# Altium project Board.PrjPcb (part 1 of 2)
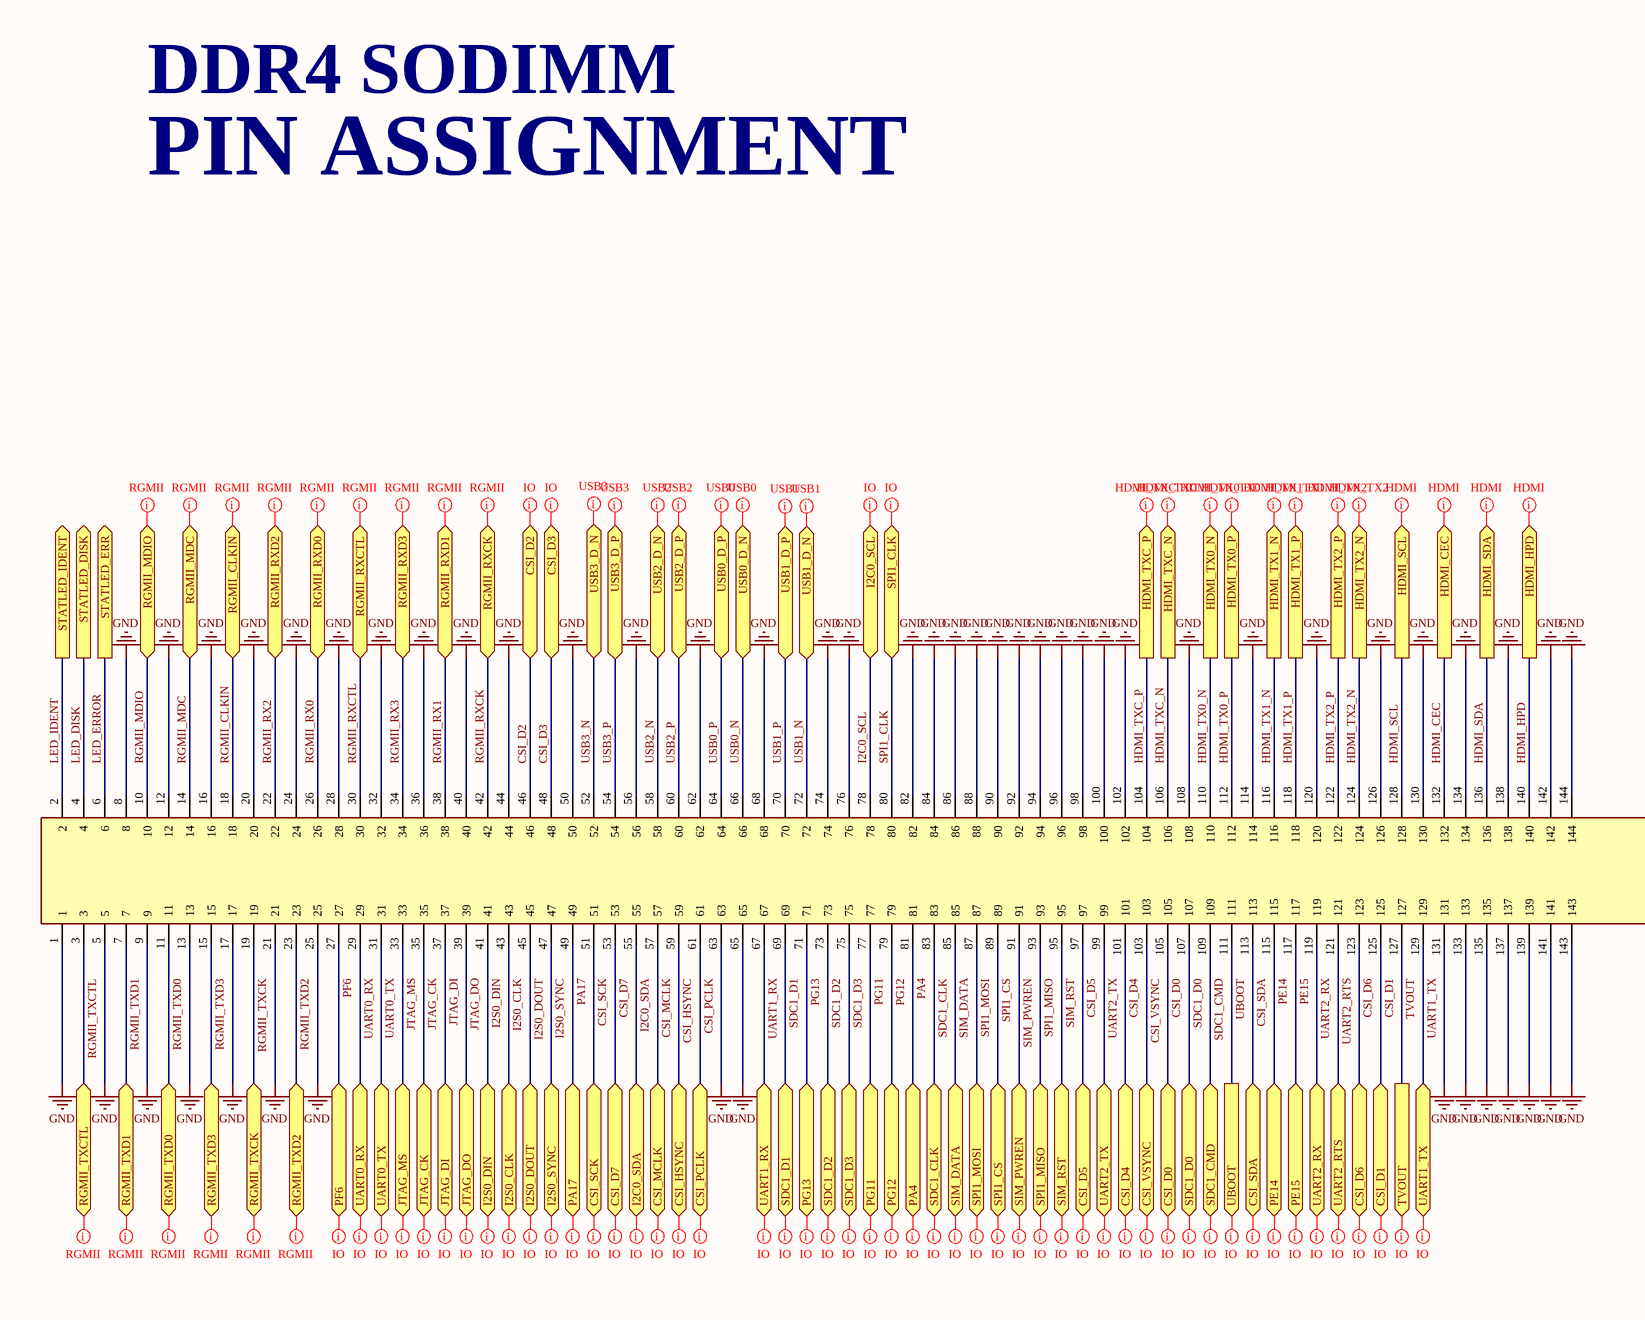
[diagram p0: 00_PINOUT.SchDoc, left]
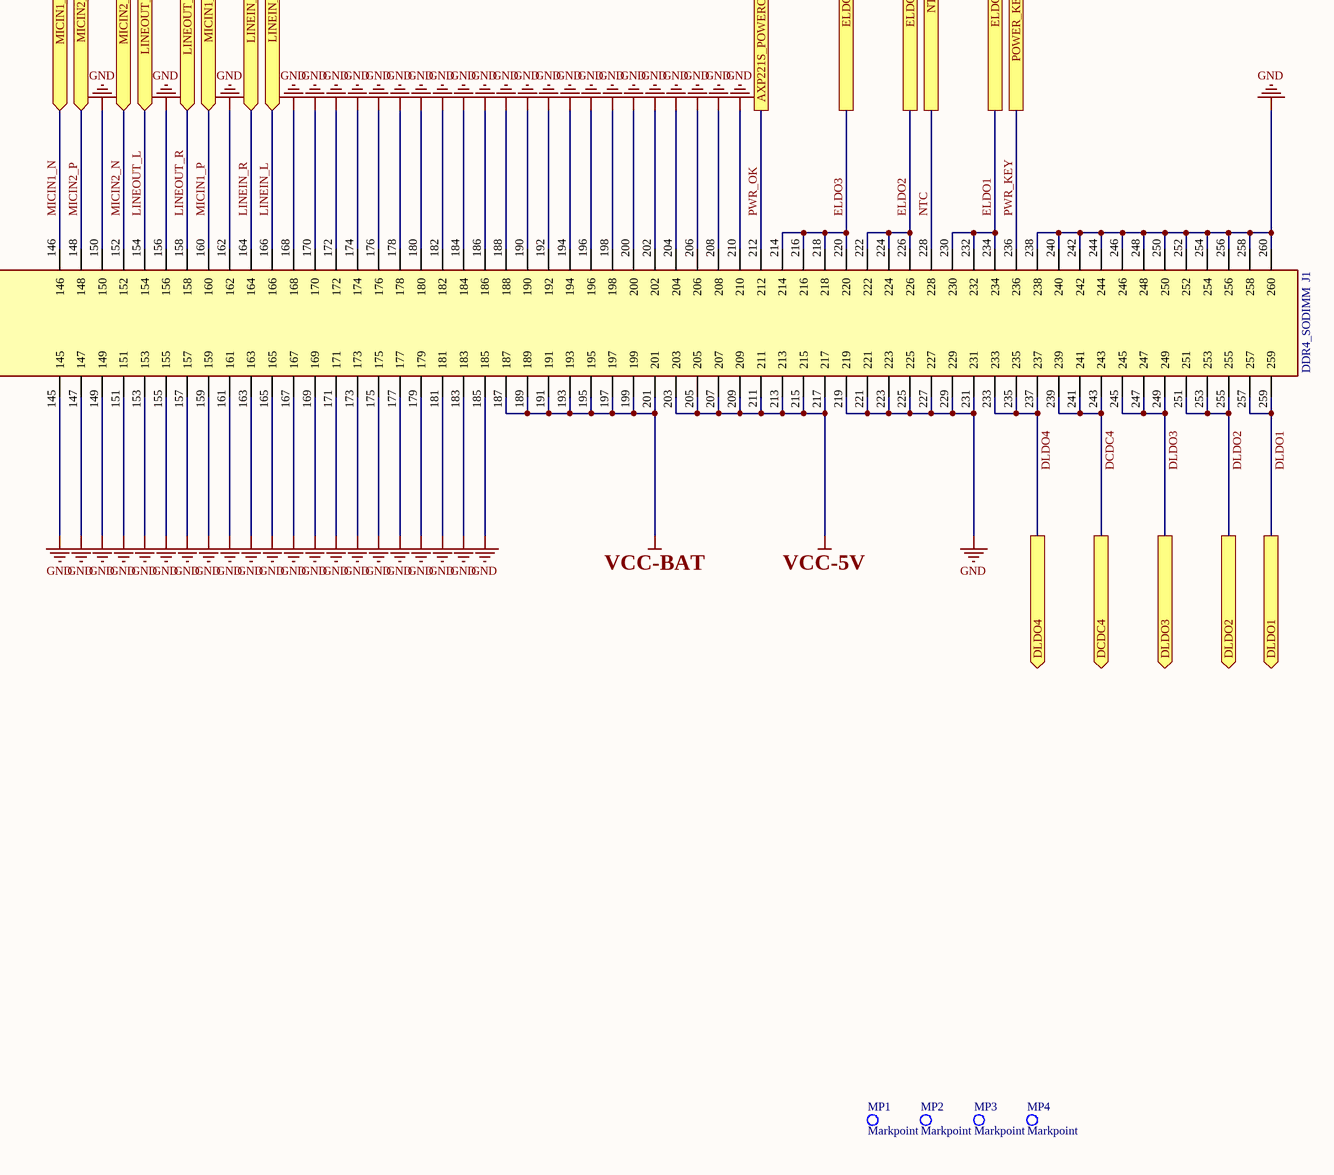
[diagram p1: 00_PINOUT.SchDoc, right]
7 sheets, 177 parts. Net scope: flat (ports and power ports of the same name join across sheets).
Board files: Board.PcbDoc, AXP221sBreakout.PcbDoc
Sheets:
  00_PINOUT.SchDoc
  01_POWER.SchDoc
  02_H3CORE.SchDoc
  03_H3DRAM.SchDoc
  04_H3STORAGE.SchDoc
  06_H3ETHERNET.SchDoc
  07_H3HDMI.SchDoc

## Sheet 00_PINOUT.SchDoc
size A2

### Parts
J1  DDR4_SODIMM  [DDR4_SODIMM]
MP1  Markpoint  [MARKPOINT]
MP2  Markpoint  [MARKPOINT]
MP3  Markpoint  [MARKPOINT]
MP4  Markpoint  [MARKPOINT]

### Ports
AXP221S_POWEROK (out), CSI_D0 (bidir), CSI_D1 (bidir), CSI_D2 (bidir), CSI_D3 (bidir), CSI_D4 (bidir), CSI_D5 (bidir), CSI_D6 (bidir), CSI_D7 (bidir), CSI_HSYNC (bidir), CSI_MCLK (bidir), CSI_PCLK (bidir), CSI_SCK (bidir), CSI_SDA (bidir), CSI_VSYNC (bidir), DCDC4 (out), DLDO1 (out), DLDO2 (out), DLDO3 (out), DLDO4 (out), ELDO1 (out), ELDO2 (out), ELDO3 (out), HDMI_CEC (out), HDMI_HPD (out), HDMI_SCL (out), HDMI_SDA (out), HDMI_TX0_N (out), HDMI_TX0_P (out), HDMI_TX1_N (out), HDMI_TX1_P (out), HDMI_TX2_N (out), HDMI_TX2_P (out), HDMI_TXC_N (out), HDMI_TXC_P (out), I2C0_SCL (bidir), I2C0_SDA (bidir), I2S0_CLK (bidir), I2S0_DIN (bidir), I2S0_DOUT (bidir), I2S0_SYNC (bidir), JTAG_CK (bidir), JTAG_DI (bidir), JTAG_DO (bidir), JTAG_MS (bidir), LINEIN_L (bidir), LINEIN_R (bidir), LINEOUT_L (bidir), LINEOUT_R (bidir), MICIN1_N (bidir), MICIN1_P (bidir), MICIN2_N (bidir), MICIN2_P (bidir), NTC (out), PA4 (bidir), PA17 (bidir), PE14 (bidir), PE15 (bidir), PF6 (bidir), PG11 (bidir), PG12 (bidir), PG13 (bidir), POWER_KEY (out), RGMII_CLKIN (bidir), RGMII_MDC (bidir), RGMII_MDIO (bidir), RGMII_RXCK (bidir), RGMII_RXCTL (bidir), RGMII_RXD0 (bidir), RGMII_RXD1 (bidir), RGMII_RXD2 (bidir), RGMII_RXD3 (bidir), RGMII_TXCK (bidir), RGMII_TXCTL (bidir), RGMII_TXD0 (bidir), RGMII_TXD1 (bidir), RGMII_TXD2 (bidir), RGMII_TXD3 (bidir), SDC1_CLK (bidir), SDC1_CMD (bidir), SDC1_D0 (bidir), SDC1_D1 (bidir), SDC1_D2 (bidir), SDC1_D3 (bidir), SIM_DATA (bidir), SIM_PWREN (bidir), SIM_RST (bidir), SPI1_CLK (bidir), SPI1_CS (bidir), SPI1_MISO (bidir), SPI1_MOSI (bidir), STATLED_DISK (out), STATLED_ERR (out), STATLED_IDENT (out), TVOUT (out), UART0_RX (bidir), UART0_TX (bidir), UART1_RX (bidir), UART1_TX (bidir), UART2_RTS (bidir), UART2_RX (bidir), UART2_TX (bidir), UBOOT (out), USB0_D_N (bidir), USB0_D_P (bidir), USB1_D_N (bidir), USB1_D_P (bidir), USB2_D_N (bidir), USB2_D_P (bidir), USB3_D_N (bidir), USB3_D_P (bidir)

### Nets
GND: J1.1 J1.5 J1.8 J1.9 J1.12 J1.13 J1.16 J1.17 J1.20 J1.21 J1.24 J1.25 J1.28 J1.32 J1.36 J1.40 J1.44 J1.50 J1.56 J1.62 J1.63 J1.65 J1.68 J1.74 J1.76 J1.82 J1.84 J1.86 J1.88 J1.90 J1.92 J1.94 J1.96 J1.98 J1.100 J1.102 J1.108 J1.114 J1.120 J1.126 J1.130 J1.131 J1.133 J1.134 J1.135 J1.137 J1.138 J1.139 J1.141 J1.142 J1.143 J1.144 J1.145 J1.147 J1.149 J1.150 J1.151 J1.153 J1.155 J1.156 J1.157 J1.159 J1.161 J1.162 J1.163 J1.165 J1.167 J1.168 J1.169 J1.170 J1.171 J1.172 J1.173 J1.174 J1.175 J1.176 J1.177 J1.178 J1.179 J1.180 J1.181 J1.182 J1.183 J1.184 J1.185 J1.186 J1.188 J1.190 J1.192 J1.194 J1.196 J1.198 J1.200 J1.202 J1.204 J1.206 J1.208 J1.210 J1.219 J1.221 J1.223 J1.225 J1.227 J1.229 J1.231 J1.238 J1.240 J1.242 J1.244 J1.246 J1.248 J1.250 J1.252 J1.254 J1.256 J1.258 J1.260
VCC-5V: J1.203 J1.205 J1.207 J1.209 J1.211 J1.213 J1.215 J1.217
VCC-BAT: J1.187 J1.189 J1.191 J1.193 J1.195 J1.197 J1.199 J1.201
CSI_D0: J1.105 ; port CSI_D0
CSI_D1: J1.125 ; port CSI_D1
CSI_D2: J1.46 ; port CSI_D2
CSI_D3: J1.48 ; port CSI_D3
CSI_D4: J1.101 ; port CSI_D4
CSI_D5: J1.97 ; port CSI_D5
CSI_D6: J1.123 ; port CSI_D6
CSI_D7: J1.53 ; port CSI_D7
CSI_HSYNC: J1.59 ; port CSI_HSYNC
CSI_MCLK: J1.57 ; port CSI_MCLK
CSI_PCLK: J1.61 ; port CSI_PCLK
CSI_SCK: J1.51 ; port CSI_SCK
CSI_SDA: J1.113 ; port CSI_SDA
CSI_VSYNC: J1.103 ; port CSI_VSYNC
DCDC4: J1.239 J1.241 J1.243 ; port DCDC4
DLDO1: J1.257 J1.259 ; port DLDO1
DLDO2: J1.251 J1.253 J1.255 ; port DLDO2
DLDO3: J1.245 J1.247 J1.249 ; port DLDO3
DLDO4: J1.233 J1.235 J1.237 ; port DLDO4
ELDO1: J1.230 J1.232 J1.234 ; port ELDO1
ELDO2: J1.222 J1.224 J1.226 ; port ELDO2
ELDO3: J1.214 J1.216 J1.218 J1.220 ; port ELDO3
HDMI_CEC: J1.132 ; port HDMI_CEC
HDMI_HPD: J1.140 ; port HDMI_HPD
HDMI_SCL: J1.128 ; port HDMI_SCL
HDMI_SDA: J1.136 ; port HDMI_SDA
HDMI_TX0_N: J1.110 ; port HDMI_TX0_N
HDMI_TX0_P: J1.112 ; port HDMI_TX0_P
HDMI_TX1_N: J1.116 ; port HDMI_TX1_N
HDMI_TX1_P: J1.118 ; port HDMI_TX1_P
HDMI_TX2_N: J1.124 ; port HDMI_TX2_N
HDMI_TX2_P: J1.122 ; port HDMI_TX2_P
HDMI_TXC_N: J1.106 ; port HDMI_TXC_N
HDMI_TXC_P: J1.104 ; port HDMI_TXC_P
I2C0_SCL: J1.78 ; port I2C0_SCL
I2C0_SDA: J1.55 ; port I2C0_SDA
I2S0_CLK: J1.43 ; port I2S0_CLK
I2S0_DIN: J1.41 ; port I2S0_DIN
I2S0_DOUT: J1.45 ; port I2S0_DOUT
I2S0_SYNC: J1.47 ; port I2S0_SYNC
JTAG_CK: J1.35 ; port JTAG_CK
JTAG_DI: J1.37 ; port JTAG_DI
JTAG_DO: J1.39 ; port JTAG_DO
JTAG_MS: J1.33 ; port JTAG_MS
LED_DISK: J1.4 ; port STATLED_DISK
LED_ERROR: J1.6 ; port STATLED_ERR  [project net LED_ERR]
LED_IDENT: J1.2 ; port STATLED_IDENT  [project net LED_ID]
LINEIN_L: J1.166 ; port LINEIN_L
LINEIN_R: J1.164 ; port LINEIN_R
LINEOUT_L: J1.154 ; port LINEOUT_L
LINEOUT_R: J1.158 ; port LINEOUT_R
MICIN1_N: J1.146 ; port MICIN1_N
MICIN1_P: J1.160 ; port MICIN1_P
MICIN2_N: J1.152 ; port MICIN2_N
MICIN2_P: J1.148 ; port MICIN2_P
NTC: J1.228 ; port NTC
PA4: J1.81 ; port PA4
PA17: J1.49 ; port PA17
PE14: J1.115 ; port PE14
PE15: J1.117 ; port PE15
PF6: J1.27 ; port PF6
PG11: J1.77 ; port PG11
PG12: J1.79 ; port PG12
PG13: J1.71 ; port PG13
PWR_KEY: J1.236 ; port POWER_KEY
PWR_OK: J1.212 ; port AXP221S_POWEROK
RGMII_CLKIN: J1.18 ; port RGMII_CLKIN
RGMII_MDC: J1.14 ; port RGMII_MDC
RGMII_MDIO: J1.10 ; port RGMII_MDIO
RGMII_RX0: J1.26 ; port RGMII_RXD0
RGMII_RX1: J1.38 ; port RGMII_RXD1
RGMII_RX2: J1.22 ; port RGMII_RXD2
RGMII_RX3: J1.34 ; port RGMII_RXD3
RGMII_RXCK: J1.42 ; port RGMII_RXCK
RGMII_RXCTL: J1.30 ; port RGMII_RXCTL
RGMII_TXCK: J1.19 ; port RGMII_TXCK
RGMII_TXCTL: J1.3 ; port RGMII_TXCTL
RGMII_TXD0: J1.11 ; port RGMII_TXD0
RGMII_TXD1: J1.7 ; port RGMII_TXD1
RGMII_TXD2: J1.23 ; port RGMII_TXD2
RGMII_TXD3: J1.15 ; port RGMII_TXD3
SDC1_CLK: J1.83 ; port SDC1_CLK
SDC1_CMD: J1.109 ; port SDC1_CMD
SDC1_D0: J1.107 ; port SDC1_D0
SDC1_D1: J1.69 ; port SDC1_D1
SDC1_D2: J1.73 ; port SDC1_D2
SDC1_D3: J1.75 ; port SDC1_D3
SIM_DATA: J1.85 ; port SIM_DATA
SIM_PWREN: J1.91 ; port SIM_PWREN
SIM_RST: J1.95 ; port SIM_RST
SPI1_CLK: J1.80 ; port SPI1_CLK
SPI1_CS: J1.89 ; port SPI1_CS
SPI1_MISO: J1.93 ; port SPI1_MISO
SPI1_MOSI: J1.87 ; port SPI1_MOSI
TVOUT: J1.127 ; port TVOUT
UART0_RX: J1.29 ; port UART0_RX
UART0_TX: J1.31 ; port UART0_TX
UART1_RX: J1.67 ; port UART1_RX
UART1_TX: J1.129 ; port UART1_TX
UART2_RTS: J1.121 ; port UART2_RTS
UART2_RX: J1.119 ; port UART2_RX
UART2_TX: J1.99 ; port UART2_TX
UBOOT: J1.111 ; port UBOOT
USB0_N: J1.66 ; port USB0_D_N
USB0_P: J1.64 ; port USB0_D_P
USB1_N: J1.72 ; port USB1_D_N
USB1_P: J1.70 ; port USB1_D_P
USB2_N: J1.58 ; port USB2_D_N
USB2_P: J1.60 ; port USB2_D_P
USB3_N: J1.52 ; port USB3_D_N
USB3_P: J1.54 ; port USB3_D_P

### Layout directives
differential pair; differential pair class USB0; rule Differential Pairs Routing [Pref Gap = 6mil    Min Gap  = 6mil    Max Gap  = 6milPref Width = 4.29mil    Min Width  = 4.29mil    Max Width  = 4.29mil]; net class USB: USB0_N, USB0_P
differential pair; differential pair class USB2; rule Differential Pairs Routing [Pref Gap = 6mil    Min Gap  = 6mil    Max Gap  = 6milPref Width = 4.29mil    Min Width  = 4.29mil    Max Width  = 4.29mil]; net class USB: USB2_N, USB2_P
differential pair; differential pair class USB3; rule Differential Pairs Routing [Pref Gap = 6mil    Min Gap  = 6mil    Max Gap  = 6milPref Width = 4.29mil    Min Width  = 4.29mil    Max Width  = 4.29mil]; net class USB: USB3_N, USB3_P
differential pair; differential pair class USB1; rule Differential Pairs Routing [Pref Gap = 6mil    Min Gap  = 6mil    Max Gap  = 6milPref Width = 4.29mil    Min Width  = 4.29mil    Max Width  = 4.29mil]; net class USB: USB1_N, USB1_P
net class RGMII; rule Width Constraint [Pref Width = 4.99mil    Min Width = 4.99mil    Max Width = 4.99mil]: RGMII_CLKIN, RGMII_MDC, RGMII_MDIO, RGMII_RX0, RGMII_RX1, RGMII_RX2, RGMII_RX3, RGMII_RXCK, RGMII_RXCTL, RGMII_TXCK, RGMII_TXCTL, RGMII_TXD0, RGMII_TXD1, RGMII_TXD2, RGMII_TXD3
net class GPIO: I2C0_SCL, I2C0_SDA, I2S0_CLK, I2S0_DIN, I2S0_DOUT, I2S0_SYNC, JTAG_CK, JTAG_DI, JTAG_DO, JTAG_MS, LINEIN_L, LINEIN_R, LINEOUT_L, LINEOUT_R, MICIN1_N, MICIN1_P, MICIN2_N, MICIN2_P, PA4, PA17, PE14, PE15, PF6, PG11, PG12, PG13, SDC1_CLK, SDC1_CMD, SDC1_D0, SDC1_D1, SDC1_D2, SDC1_D3, SIM_DATA, SIM_PWREN, SIM_RST, SPI1_CLK, SPI1_CS, SPI1_MISO, SPI1_MOSI, TVOUT, UART0_RX, UART0_TX, UART1_RX, UART1_TX, UART2_RTS, UART2_RX, UART2_TX, UBOOT
differential pair; differential pair class HDMI_TX0; rule Differential Pairs Routing [Pref Gap = 6mil    Min Gap  = 6mil    Max Gap  = 6milPref Width = 4.29mil    Min Width  = 4.29mil    Max Width  = 4.29mil]; net class HDMI: HDMI_TX0_N, HDMI_TX0_P
differential pair; differential pair class HDMI_TX1; rule Differential Pairs Routing [Pref Gap = 6mil    Min Gap  = 6mil    Max Gap  = 6milPref Width = 4.29mil    Min Width  = 4.29mil    Max Width  = 4.29mil]; net class HDMI: HDMI_TX1_N, HDMI_TX1_P
differential pair; differential pair class HDMI_TX2; rule Differential Pairs Routing [Pref Gap = 6mil    Min Gap  = 6mil    Max Gap  = 6milPref Width = 4.29mil    Min Width  = 4.29mil    Max Width  = 4.29mil]; net class HDMI: HDMI_TX2_N, HDMI_TX2_P
differential pair; differential pair class HDMI_TXC; rule Differential Pairs Routing [Pref Gap = 6mil    Min Gap  = 6mil    Max Gap  = 6milPref Width = 4.29mil    Min Width  = 4.29mil    Max Width  = 4.29mil]; net class HDMI: HDMI_TXC_N, HDMI_TXC_P
net class GPIO; net class CSI: CSI_D0, CSI_D1, CSI_D2, CSI_D3, CSI_D4, CSI_D5, CSI_D6, CSI_D7, CSI_HSYNC, CSI_MCLK, CSI_PCLK, CSI_SCK, CSI_SDA, CSI_VSYNC
net class HDMI; rule Width Constraint [Pref Width = 4.99mil    Min Width = 4.99mil    Max Width = 4.99mil]: HDMI_CEC, HDMI_HPD, HDMI_SCL, HDMI_SDA

### Notes on the sheet
- DDR4 SODIMM
- PIN ASSIGNMENT

## Sheet 01_POWER.SchDoc
size 566 x 498 mm
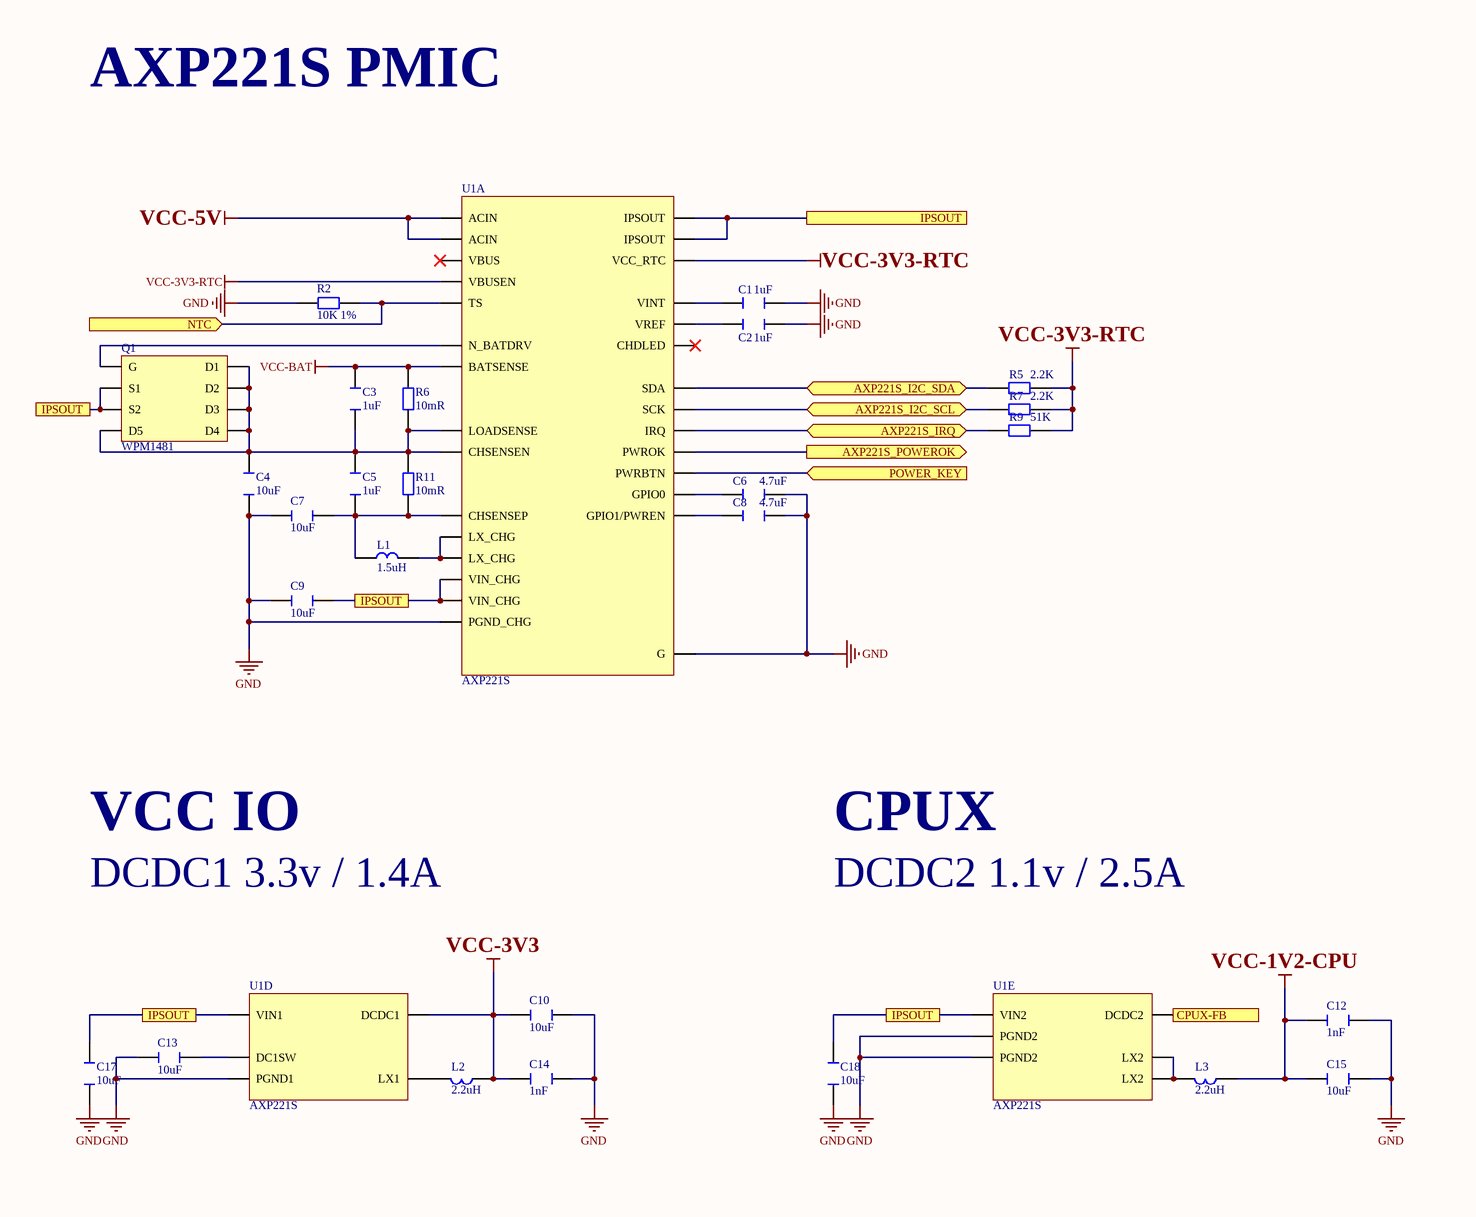
[diagram p2: 01_POWER.SchDoc, top left]
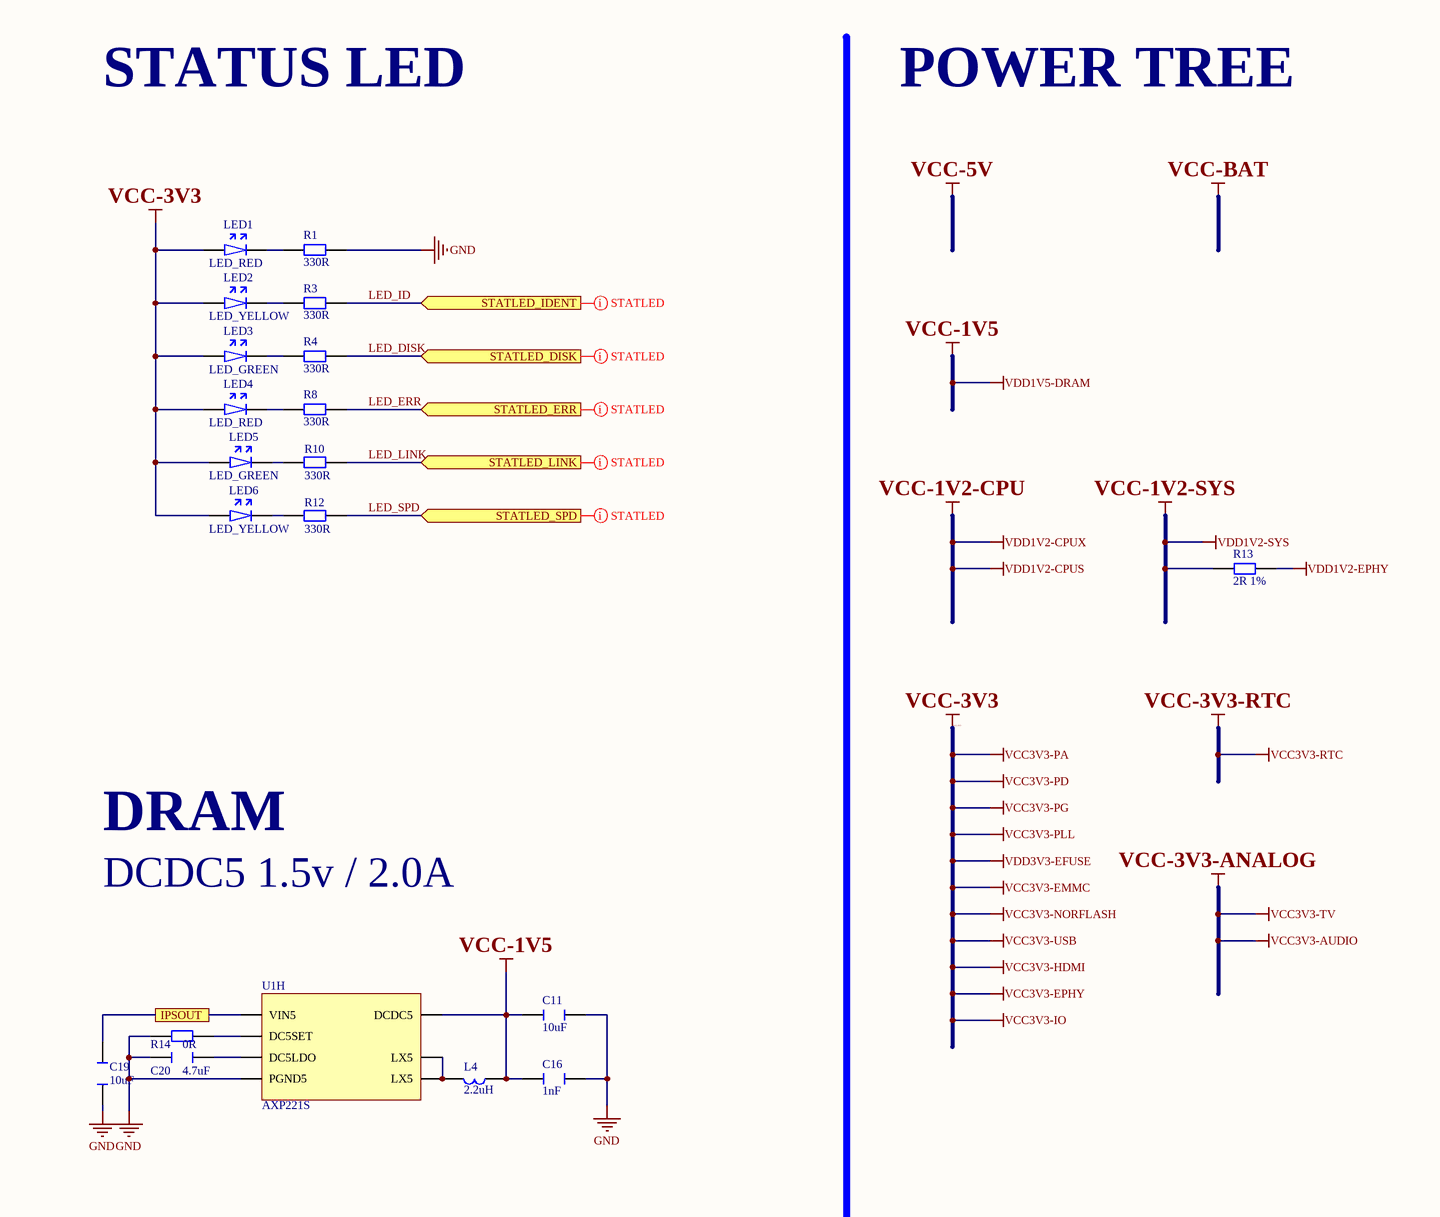
[diagram p3: 01_POWER.SchDoc, top right]
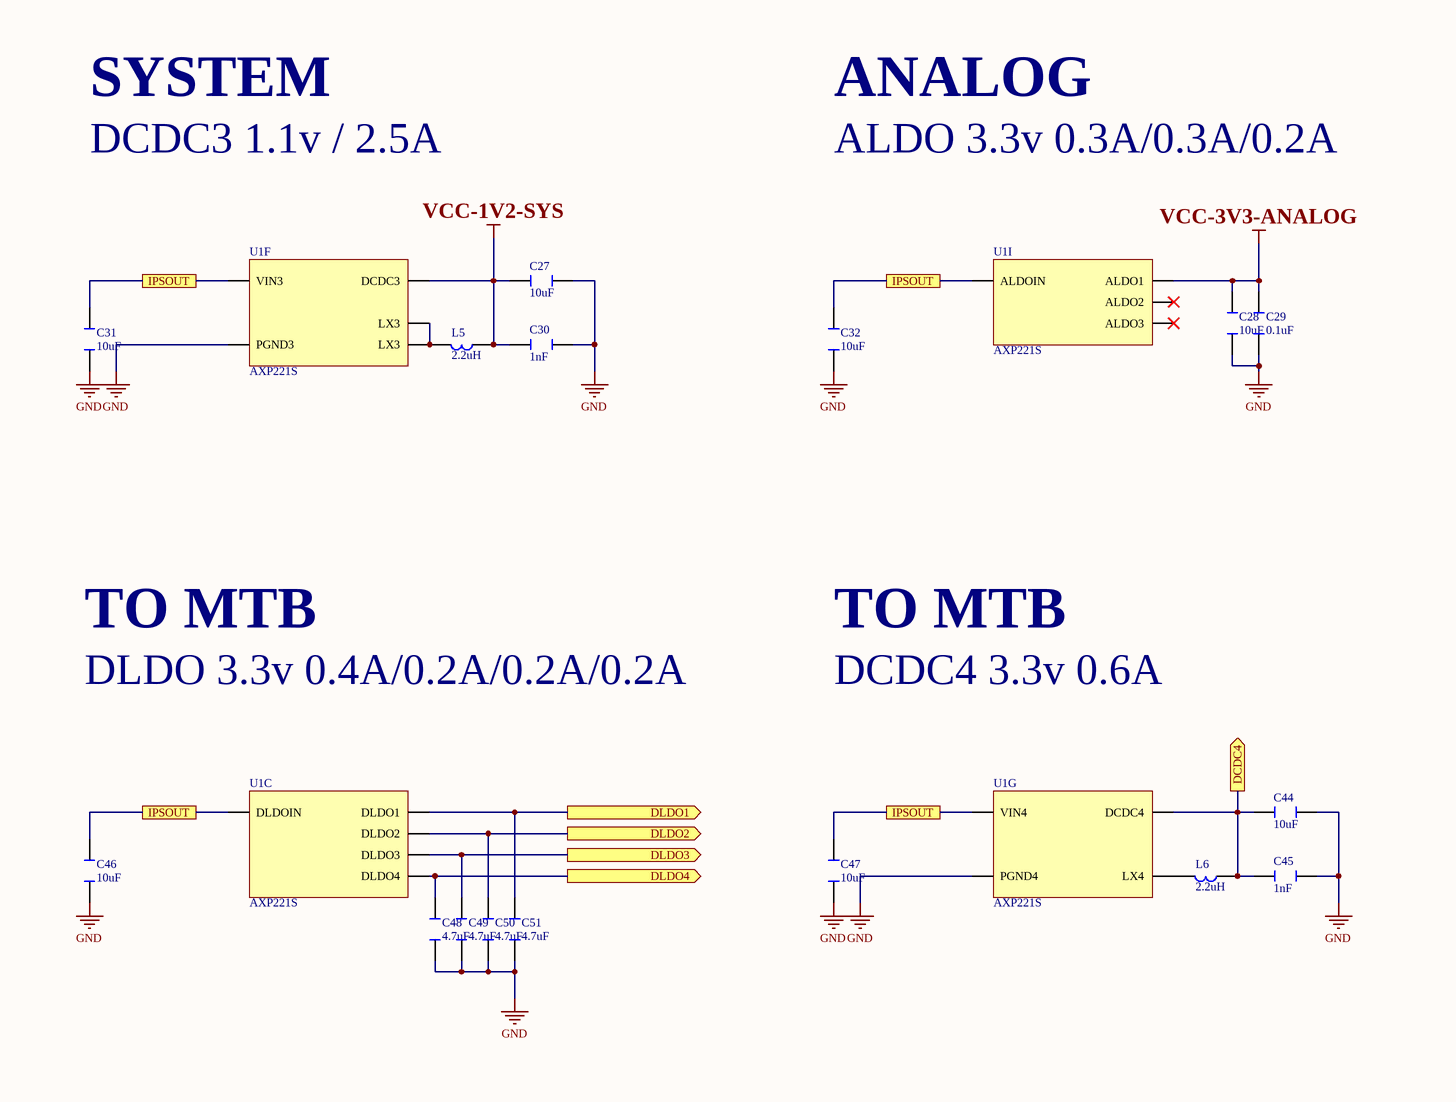
[diagram p4: 01_POWER.SchDoc, bottom left]
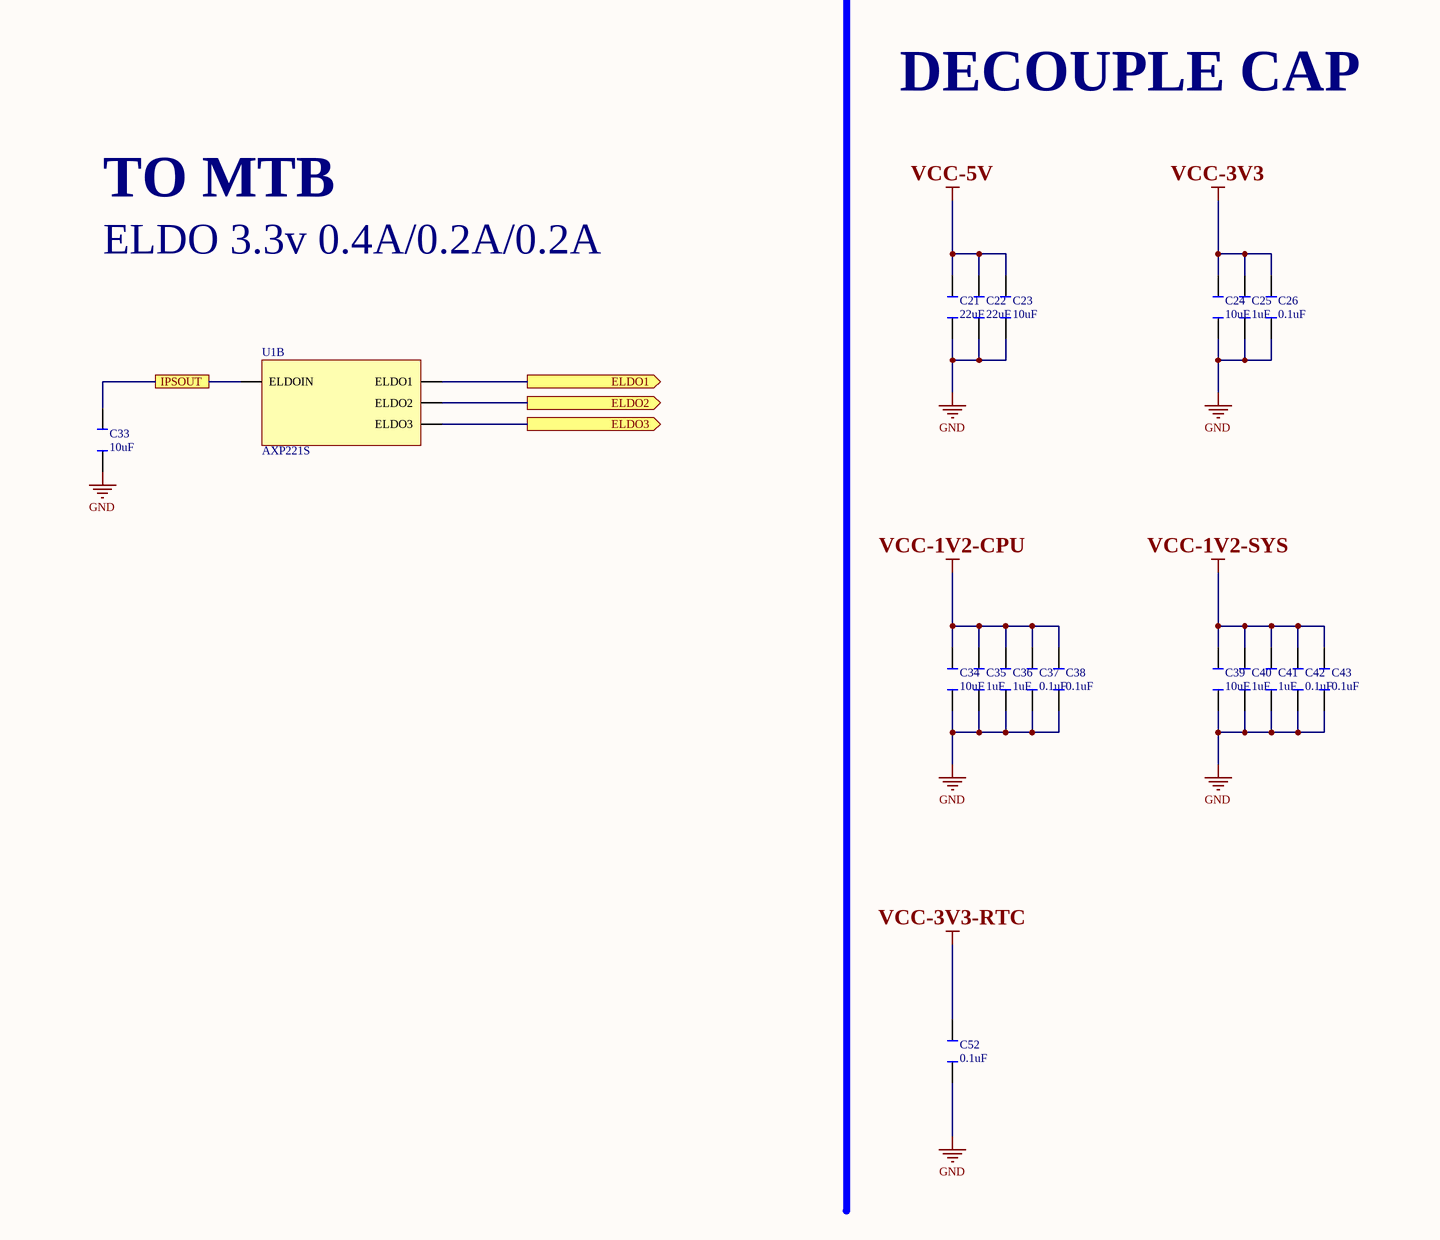
[diagram p5: 01_POWER.SchDoc, bottom right]

### Parts
C1  1uF  [C0603]
C2  1uF  [C0603]
C3  1uF  [C0603]
C4  10uF  [C0603]
C5  1uF  [C0603]
C6  4.7uF  [C0402]
C7  10uF  [C0603]
C8  4.7uF  [C0402]
C9  10uF  [C0603]
C10  10uF  [C0603]
C11  10uF  [C0603]
C12  1nF  [C0603]
C13  10uF  [C0603]
C14  1nF  [C0603]
C15  10uF  [C0603]
C16  1nF  [C0603]
C17  10uF  [C0603]
C18  10uF  [C0603]
C19  10uF  [C0603]
C20  4.7uF  [C0603]
C21  22uF  [C0603]
C22  22uF  [C0603]
C23  10uF  [C0603]
C24  10uF  [C0603]
C25  1uF  [C0402]
C26  0.1uF  [C0603]
C27  10uF  [C0603]
C28  10uF  [C0603]
C29  0.1uF  [C0603]
C30  1nF  [C0603]
C31  10uF  [C0603]
C32  10uF  [C0603]
C33  10uF  [C0603]
C34  10uF  [C0603]
C35  1uF  [C0603]
C36  1uF  [C0603]
C37  0.1uF  [C0402]
C38  0.1uF  [C0402]
C39  10uF  [C0603]
C40  1uF  [C0402]
C41  1uF  [C0603]
C42  0.1uF  [C0402]
C43  0.1uF  [C0402]
C44  10uF  [C0603]
C45  1nF  [C0603]
C46  10uF  [C0603]
C47  10uF  [C0603]
C48  4.7uF  [C0603]
C49  4.7uF  [C0603]
C50  4.7uF  [C0603]
C51  4.7uF  [C0603]
C52  0.1uF  [C0402]
L1  1.5uH  [L2520]
L2  2.2uH  [L2520]
L3  2.2uH  [L2520]
L4  2.2uH  [L2520]
L5  2.2uH  [L2520]
L6  2.2uH  [L2520]
LED1  LED_RED  [LED0603_RED]
LED2  LED_YELLOW  [LED0603_YELLOW]
LED3  LED_GREEN  [LED0603_GREEN]
LED4  LED_RED  [LED0603_RED]
LED5  LED_GREEN  [LED0603_GREEN]
LED6  LED_YELLOW  [LED0603_YELLOW]
Q1  WPM1481  [WPM1481]
R1  330R  [R0402]
R2  10K 1%  [R0402]
R3  330R  [R0402]
R4  330R  [R0402]
R5  2.2K  [R0402]
R6  10mR  [R0805]
R7  2.2K  [R0402]
R8  330R  [R0402]
R9  51K  [R0402]
R10  330R  [R0402]
R11  10mR  [R0805]
R12  330R  [R0402]
R13  2R 1%  [R0402]
R14  0R  [R0402]
U1  AXP221S  [AXP221S]  (parts A,B,C,D,E,F,G,H,I of 9)

### Ports
AXP221S_I2C_SCL (bidir), AXP221S_I2C_SDA (bidir), AXP221S_IRQ (bidir), AXP221S_POWEROK (out), CPUX-FB (out), DCDC4 (out), DLDO1 (out), DLDO2 (out), DLDO3 (out), DLDO4 (out), ELDO1 (out), ELDO2 (out), ELDO3 (out), IPSOUT, NTC (in), POWER_KEY (in), STATLED_DISK (in), STATLED_ERR (in), STATLED_IDENT (in), STATLED_LINK (in), STATLED_SPD (in)

### Nets
GND: C1.2 C2.2 C4.1 C6.2 C7.1 C8.2 C9.1 C10.2 C11.2 C12.2 C13.1 C14.1 C15.2 C16.2 C17.2 C18.2 C19.2 C20.2 C21.1 C22.1 C23.1 C24.1 C25.1 C26.1 C27.2 C28.2 C29.1 C30.2 C31.2 C32.2 C33.2 C34.1 C35.1 C36.1 C37.1 C38.1 C39.1 C40.1 C41.1 C42.1 C43.1 C44.2 C45.2 C46.2 C47.2 C48.1 C49.1 C50.1 C51.1 C52.1 R1.2 R2.1 R14.1 U1.6(PGND5) U1.15(PGND1) U1.26(PGND2) U1.27(PGND2) U1.42(PGND3) U1.59(PGND_CHG) U1.66(PGND4) U1.69(G)
VCC-1V2-CPU: C12.1 C15.1 C34.2 C35.2 C36.2 C37.2 C38.2 L3.1  [also labelled VDD1V2-CPUS, VDD1V2-CPUX]
VCC-1V2-SYS: C27.1 C30.1 C39.2 C40.2 C41.2 C42.2 C43.2 L5.1 R13.1 U1.38(DCDC3)  [also labelled VDD1V2-SYS]
VCC-1V5: C11.1 C16.1 L4.1 U1.5(DCDC5)  [also labelled VDD1V5-DRAM]
VCC-3V3: C10.1 C14.2 C24.2 C25.2 C26.2 L2.1 LED1.1 LED2.1 LED3.1 LED4.1 LED5.1 LED6.1 U1.21(DCDC1)  [also labelled VCC3V3-EMMC, VCC3V3-EPHY, VCC3V3-HDMI, VCC3V3-IO, VCC3V3-NORFLASH, VCC3V3-PA, VCC3V3-PD, VCC3V3-PG, VCC3V3-PLL, VCC3V3-USB, VDD3V3-EFUSE]
VCC-3V3-ANALOG: C28.1 C29.2 U1.32(ALDO1)  [also labelled VCC3V3-AUDIO, VCC3V3-TV]
VCC-3V3-RTC: C52.2 R5.2 R7.2 R9.2 U1.11(VBUSEN) U1.46(VCC_RTC)  [also labelled VCC3V3-RTC]
VCC-5V: C21.2 C22.2 C23.2 U1.55(ACIN) U1.56(ACIN)
VCC-BAT: C3.2 R6.2 U1.49(BATSENSE)
VDD1V2-EPHY: R13.2
DCDC4: C44.1 C45.1 L6.1 U1.67(DCDC4) ; port DCDC4
DLDO1: C51.2 U1.19(DLDO1) ; port DLDO1
DLDO2: C50.2 U1.17(DLDO2) ; port DLDO2
DLDO3: C49.2 U1.16(DLDO3) ; port DLDO3
DLDO4: C48.2 U1.20(DLDO4) ; port DLDO4
ELDO1: U1.68(ELDO1) ; port ELDO1
ELDO2: U1.2(ELDO2) ; port ELDO2
ELDO3: U1.3(ELDO3) ; port ELDO3
LED_DISK: R4.2 ; port STATLED_DISK
LED_ERR: R8.2 ; port STATLED_ERR
LED_ID: R3.2 ; port STATLED_IDENT
LED_LINK: R10.1 ; port STATLED_LINK
LED_SPD: R12.1 ; port STATLED_SPD
NTC: R2.2 U1.30(TS) ; port NTC
PWR_KEY: U1.12(PWRBTN) ; port POWER_KEY
PWR_OK: U1.43(PWROK) ; port AXP221S_POWEROK
NetC1_1: C1.1 U1.47(VINT)
NetC2_1: C2.1 U1.35(VREF)
NetC3_1: C3.1 C4.2 C5.2 Q1.1(D1) Q1.2(D2) Q1.5(D3) Q1.6(D4) Q1.8(D5) R6.1 R11.2 U1.50(LOADSENSE) U1.58(CHSENSEN)
NetC5_1: C5.1 C7.2 L1.1 R11.1 U1.57(CHSENSEP)
NetC6_1: C6.1 U1.37(GPIO0)
NetC8_1: C8.1 U1.31(GPIO1/PWREN)
NetC9_2: C9.2 C17.1 C18.1 C19.1 C31.1 C32.1 C33.1 C46.1 C47.1 Q1.4(S1) Q1.7(S2) U1.1(ELDOIN) U1.9(VIN5) U1.13(VIN1) U1.18(DLDOIN) U1.23(VIN2) U1.33(ALDOIN) U1.39(VIN3) U1.53(IPSOUT) U1.54(IPSOUT) U1.62(VIN_CHG) U1.63(VIN_CHG) U1.64(VIN4) ; port IPSOUT
NetC13_2: C13.2 U1.22(DC1SW)
NetC20_1: C20.1 U1.4(DC5LDO)
NetL1_2: L1.2 U1.60(LX_CHG) U1.61(LX_CHG)
NetL2_2: L2.2 U1.14(LX1)
NetL3_2: L3.2 U1.24(LX2) U1.25(LX2)
NetL4_2: L4.2 U1.7(LX5) U1.8(LX5)
NetL5_2: L5.2 U1.40(LX3) U1.41(LX3)
NetL6_2: L6.2 U1.65(LX4)
NetLED1_2: LED1.2 R1.1
NetLED2_2: LED2.2 R3.1
NetLED3_2: LED3.2 R4.1
NetLED4_2: LED4.2 R8.1
NetLED5_2: LED5.2 R10.2
NetLED6_2: LED6.2 R12.2
NetQ1_3: Q1.3(G) U1.51(N_BATDRV)
NetR5_1: R5.1 U1.45(SDA) ; port AXP221S_I2C_SDA
NetR7_1: R7.1 U1.44(SCK) ; port AXP221S_I2C_SCL
NetR9_1: R9.1 U1.29(IRQ) ; port AXP221S_IRQ
NetR14_2: R14.2 U1.10(DC5SET)
NetU1_28: U1.28(DCDC2) ; port CPUX-FB

Not connected (* = marked no-connect by the designer): U1 34(ALDO2)* 36(ALDO3)* 48(VBUS)* 52(CHDLED)*

### Layout directives
net class STATLED: LED_DISK, LED_ERR, LED_ID, LED_LINK, LED_SPD

### Notes on the sheet
- AXP221S PMIC
- STATUS LED
- POWER TREE
- VCC IO
- CPUX
- DRAM
- DCDC1 3.3v / 1.4A
- DCDC2 1.1v / 2.5A
- DCDC5 1.5v / 2.0A
- DECOUPLE CAP
- SYSTEM
- ANALOG
- TO MTB
- DCDC3 1.1v / 2.5A
- ALDO 3.3v 0.3A/0.3A/0.2A
- ELDO 3.3v 0.4A/0.2A/0.2A
- DLDO 3.3v 0.4A/0.2A/0.2A/0.2A
- DCDC4 3.3v 0.6A

### Library data of the parts
C1-C3 C5 C25 C35 C36 C40 C41 = C_1UF
C4 C7 C9-C11 C13 C15 C17-C19 C23 C24 C27 C28 C31-C34 C39 C44 C46 C47 = C_10UF
C6 C8 C20 C48-C51 = C_4.7UF
C12 C14 C16 C30 C45 = C_1NF
C21 C22 = C_22UF
C26 C29 C37 C38 C42 C43 C52 = C_0.1UF
L1 = L_1.5UH
L2-L6 = L_2.2UH
R1 R3 R4 R8 R10 R12 = R_330R
R2 = R_10K_P1
R5 R7 = R_2.2K
R6 R11 = R_10mR
R9 = R_51K
R13 = R_2R_P1
R14 = R_0R

## Sheet 02_H3CORE.SchDoc
size A2
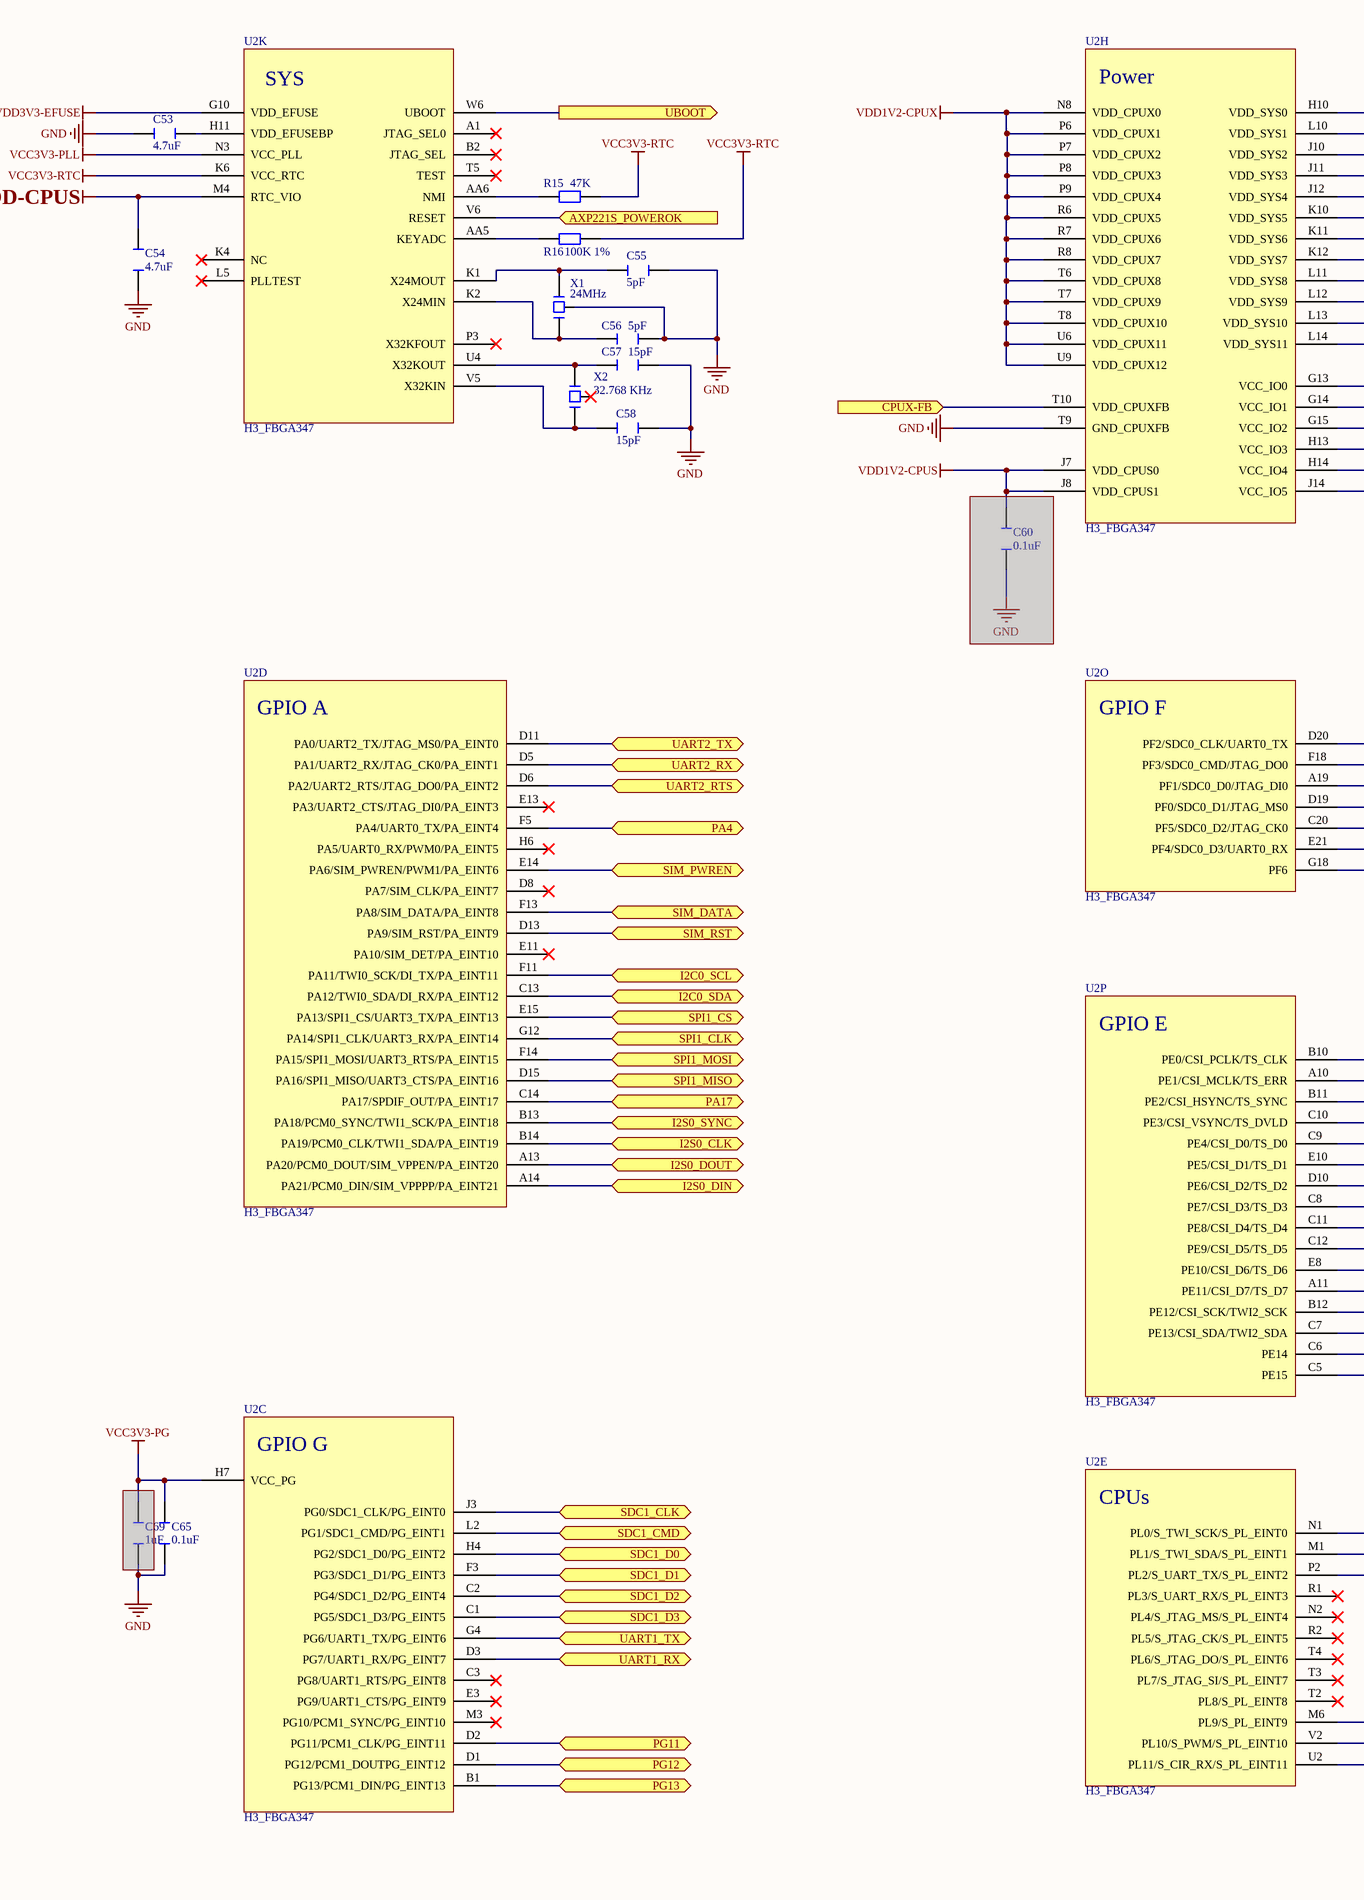
[diagram p6: 02_H3CORE.SchDoc, left]
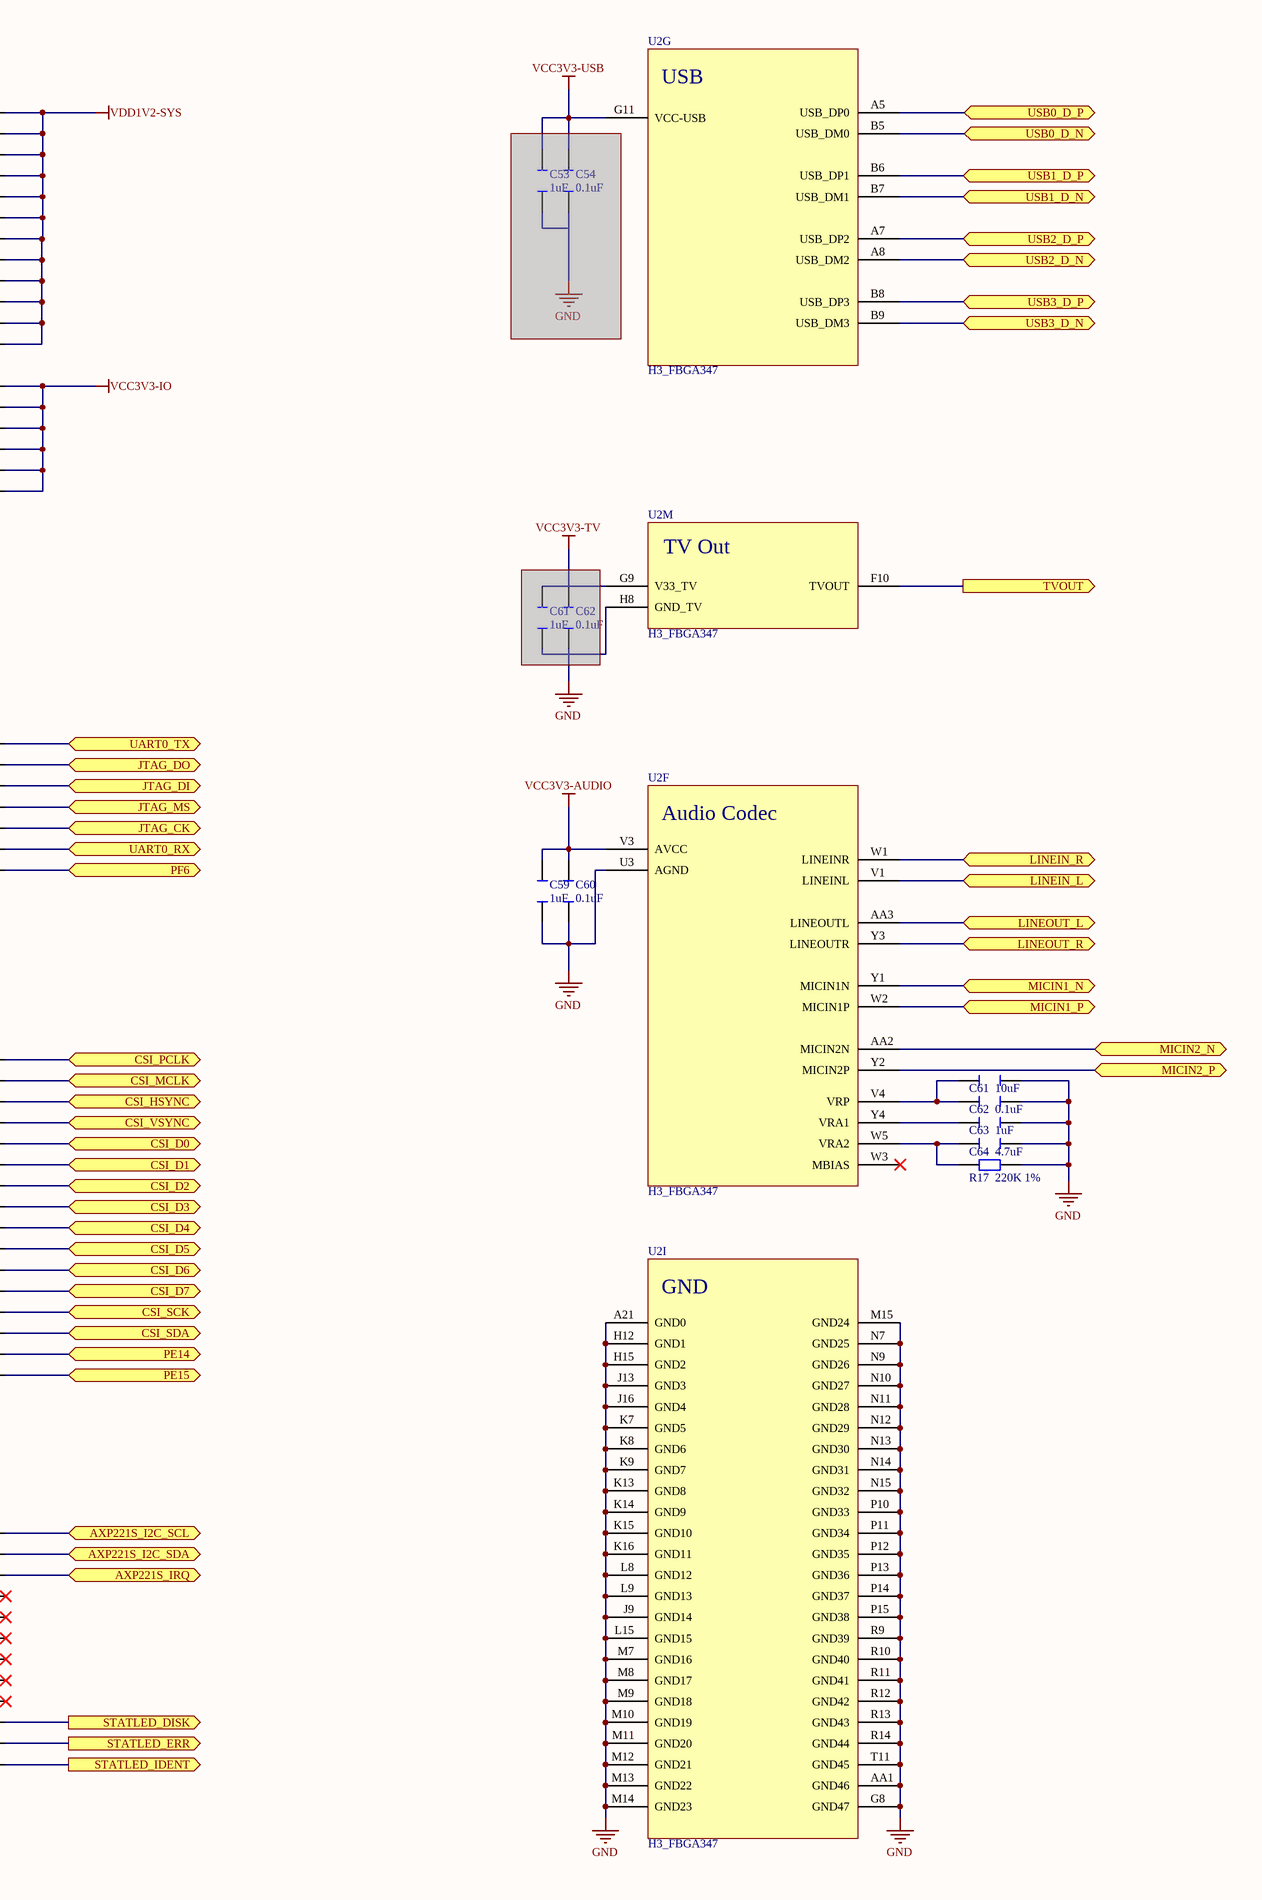
[diagram p7: 02_H3CORE.SchDoc, right]

### Parts
(Parts that share a designator on the sheet are numbered #1, #2 ... from top to bottom, then left to right.)
C53#1  4.7uF  [C0402]
C53#2  1uF  [C0402]  (masked out: inside a compile mask, not in the netlist)
C54#1  0.1uF  [C0402]  (masked out: inside a compile mask, not in the netlist)
C54#2  4.7uF  [C0402]
C55  5pF  [C0402]
C56  5pF  [C0402]
C57  15pF  [C0402]
C58  15pF  [C0402]
C59  1uF  [C0402]
C60#1  0.1uF  [C0402]  (masked out: inside a compile mask, not in the netlist)
C60#2  0.1uF  [C0402]
C61#1  1uF  [C0402]  (masked out: inside a compile mask, not in the netlist)
C61#2  10uF  [C0402]
C62#1  0.1uF  [C0402]  (masked out: inside a compile mask, not in the netlist)
C62#2  0.1uF  [C0402]
C63  1uF  [C0402]
C64  4.7uF  [C0402]
C65  0.1uF  [C0402]
C69#1  1uF  [C0402]  (masked out: inside a compile mask, not in the netlist)
R15  47K  [R0402]
R16  100K 1%  [R0402]
R17  220K 1%  [R0402]
U2  H3_FBGA347  [H3_FBGA327]  (parts C,D,E,F,G,H,I,K,M,O,P of 16)
X1  24MHz  [SMD3225]
X2  32.768 KHz  [FC_135]

### Ports
AXP221S_I2C_SCL (bidir), AXP221S_I2C_SDA (bidir), AXP221S_IRQ (bidir), AXP221S_POWEROK (in), CPUX-FB (in), CSI_D0 (bidir), CSI_D1 (bidir), CSI_D2 (bidir), CSI_D3 (bidir), CSI_D4 (bidir), CSI_D5 (bidir), CSI_D6 (bidir), CSI_D7 (bidir), CSI_HSYNC (bidir), CSI_MCLK (bidir), CSI_PCLK (bidir), CSI_SCK (bidir), CSI_SDA (bidir), CSI_VSYNC (bidir), I2C0_SCL (bidir), I2C0_SDA (bidir), I2S0_CLK (bidir), I2S0_DIN (bidir), I2S0_DOUT (bidir), I2S0_SYNC (bidir), JTAG_CK (bidir), JTAG_DI (bidir), JTAG_DO (bidir), JTAG_MS (bidir), LINEIN_L (bidir), LINEIN_R (bidir), LINEOUT_L (bidir), LINEOUT_R (bidir), MICIN1_N (bidir), MICIN1_P (bidir), MICIN2_N (bidir), MICIN2_P (bidir), PA4 (bidir), PA17 (bidir), PE14 (bidir), PE15 (bidir), PF6 (bidir), PG11 (bidir), PG12 (bidir), PG13 (bidir), SDC1_CLK (bidir), SDC1_CMD (bidir), SDC1_D0 (bidir), SDC1_D1 (bidir), SDC1_D2 (bidir), SDC1_D3 (bidir), SIM_DATA (bidir), SIM_PWREN (bidir), SIM_RST (bidir), SPI1_CLK (bidir), SPI1_CS (bidir), SPI1_MISO (bidir), SPI1_MOSI (bidir), STATLED_DISK (out), STATLED_ERR (out), STATLED_IDENT (out), TVOUT (out), UART0_RX (bidir), UART0_TX (bidir), UART1_RX (bidir), UART1_TX (bidir), UART2_RTS (bidir), UART2_RX (bidir), UART2_TX (bidir), UBOOT (out), USB0_D_N (bidir), USB0_D_P (bidir), USB1_D_N (bidir), USB1_D_P (bidir), USB2_D_N (bidir), USB2_D_P (bidir), USB3_D_N (bidir), USB3_D_P (bidir)

### Nets
GND: C53#1.1 C54#2.1 C55.2 C56.2 C57.2 C58.2 C59.1 C60#2.1 C61#2.2 C62#2.2 C63.2 C64.2 C65.1 R17.2 U2.A21(GND0) U2.AA1(GND46) U2.G8(GND47) U2.H8(GND_TV) U2.H12(GND1) U2.H15(GND2) U2.J9(GND14) U2.J13(GND3) U2.J16(GND4) U2.K7(GND5) U2.K8(GND6) U2.K9(GND7) U2.K13(GND8) U2.K14(GND9) U2.K15(GND10) U2.K16(GND11) U2.L8(GND12) U2.L9(GND13) U2.L15(GND15) U2.M7(GND16) U2.M8(GND17) U2.M9(GND18) U2.M10(GND19) U2.M11(GND20) U2.M12(GND21) U2.M13(GND22) U2.M14(GND23) U2.M15(GND24) U2.N7(GND25) U2.N9(GND26) U2.N10(GND27) U2.N11(GND28) U2.N12(GND29) U2.N13(GND30) U2.N14(GND31) U2.N15(GND32) U2.P10(GND33) U2.P11(GND34) U2.P12(GND35) U2.P13(GND36) U2.P14(GND37) U2.P15(GND38) U2.R9(GND39) U2.R10(GND40) U2.R11(GND41) U2.R12(GND42) U2.R13(GND43) U2.R14(GND44) U2.T9(GND_CPUXFB) U2.T11(GND45) U2.U3(AGND) X1.3(G)
VCC3V3-AUDIO: C59.2 C60#2.2 U2.G9(V33_TV) U2.V3(AVCC)  [also labelled VCC3V3-TV]  [project net VCC-3V3-ANALOG]
VCC3V3-IO: C65.2 U2.G10(VDD_EFUSE) U2.G11(VCC-USB) U2.G13(VCC_IO0) U2.G14(VCC_IO1) U2.G15(VCC_IO2) U2.H7(VCC_PG) U2.H13(VCC_IO3) U2.H14(VCC_IO4) U2.J14(VCC_IO5) U2.N3(VCC_PLL)  [also labelled VCC3V3-PG, VCC3V3-PLL, VCC3V3-USB, VDD3V3-EFUSE]  [project net VCC-3V3]
VCC3V3-RTC: R15.2 R16.2 U2.K6(VCC_RTC)  [project net VCC-3V3-RTC]
VDD1V2-CPUS: U2.J7(VDD_CPUS0) U2.J8(VDD_CPUS1) U2.N8(VDD_CPUX0) U2.P6(VDD_CPUX1) U2.P7(VDD_CPUX2) U2.P8(VDD_CPUX3) U2.P9(VDD_CPUX4) U2.R6(VDD_CPUX5) U2.R7(VDD_CPUX6) U2.R8(VDD_CPUX7) U2.T6(VDD_CPUX8) U2.T7(VDD_CPUX9) U2.T8(VDD_CPUX10) U2.U6(VDD_CPUX11) U2.U9(VDD_CPUX12)  [also labelled VDD1V2-CPUX]  [project net VCC-1V2-CPU]
VDD1V2-SYS: U2.H10(VDD_SYS0) U2.J10(VDD_SYS2) U2.J11(VDD_SYS3) U2.J12(VDD_SYS4) U2.K10(VDD_SYS5) U2.K11(VDD_SYS6) U2.K12(VDD_SYS7) U2.L10(VDD_SYS1) U2.L11(VDD_SYS8) U2.L12(VDD_SYS9) U2.L13(VDD_SYS10) U2.L14(VDD_SYS11)  [project net VCC-1V2-SYS]
VDD-CPUS: C54#2.2 U2.M4(RTC_VIO)
CSI_D0: U2.C9(PE4/CSI_D0/TS_D0) ; port CSI_D0
CSI_D1: U2.E10(PE5/CSI_D1/TS_D1) ; port CSI_D1
CSI_D2: U2.D10(PE6/CSI_D2/TS_D2) ; port CSI_D2
CSI_D3: U2.C8(PE7/CSI_D3/TS_D3) ; port CSI_D3
CSI_D4: U2.C11(PE8/CSI_D4/TS_D4) ; port CSI_D4
CSI_D5: U2.C12(PE9/CSI_D5/TS_D5) ; port CSI_D5
CSI_D6: U2.E8(PE10/CSI_D6/TS_D6) ; port CSI_D6
CSI_D7: U2.A11(PE11/CSI_D7/TS_D7) ; port CSI_D7
CSI_HSYNC: U2.B11(PE2/CSI_HSYNC/TS_SYNC) ; port CSI_HSYNC
CSI_MCLK: U2.A10(PE1/CSI_MCLK/TS_ERR) ; port CSI_MCLK
CSI_PCLK: U2.B10(PE0/CSI_PCLK/TS_CLK) ; port CSI_PCLK
CSI_SCK: U2.B12(PE12/CSI_SCK/TWI2_SCK) ; port CSI_SCK
CSI_SDA: U2.C7(PE13/CSI_SDA/TWI2_SDA) ; port CSI_SDA
CSI_VSYNC: U2.C10(PE3/CSI_VSYNC/TS_DVLD) ; port CSI_VSYNC
I2C0_SCL: U2.F11(PA11/TWI0_SCK/DI_TX/PA_EINT11) ; port I2C0_SCL
I2C0_SDA: U2.C13(PA12/TWI0_SDA/DI_RX/PA_EINT12) ; port I2C0_SDA
I2S0_CLK: U2.B14(PA19/PCM0_CLK/TWI1_SDA/PA_EINT19) ; port I2S0_CLK
I2S0_DIN: U2.A14(PA21/PCM0_DIN/SIM_VPPPP/PA_EINT21) ; port I2S0_DIN
I2S0_DOUT: U2.A13(PA20/PCM0_DOUT/SIM_VPPEN/PA_EINT20) ; port I2S0_DOUT
I2S0_SYNC: U2.B13(PA18/PCM0_SYNC/TWI1_SCK/PA_EINT18) ; port I2S0_SYNC
JTAG_CK: U2.C20(PF5/SDC0_D2/JTAG_CK0) ; port JTAG_CK
JTAG_DI: U2.A19(PF1/SDC0_D0/JTAG_DI0) ; port JTAG_DI
JTAG_DO: U2.F18(PF3/SDC0_CMD/JTAG_DO0) ; port JTAG_DO
JTAG_MS: U2.D19(PF0/SDC0_D1/JTAG_MS0) ; port JTAG_MS
LED_DISK: U2.M6(PL9/S_PL_EINT9) ; port STATLED_DISK
LED_ERR: U2.V2(PL10/S_PWM/S_PL_EINT10) ; port STATLED_ERR
LED_ID: U2.U2(PL11/S_CIR_RX/S_PL_EINT11) ; port STATLED_IDENT
LINEIN_L: U2.V1(LINEINL) ; port LINEIN_L
LINEIN_R: U2.W1(LINEINR) ; port LINEIN_R
LINEOUT_L: U2.AA3(LINEOUTL) ; port LINEOUT_L
LINEOUT_R: U2.Y3(LINEOUTR) ; port LINEOUT_R
MICIN1_N: U2.Y1(MICIN1N) ; port MICIN1_N
MICIN1_P: U2.W2(MICIN1P) ; port MICIN1_P
MICIN2_N: U2.AA2(MICIN2N) ; port MICIN2_N
MICIN2_P: U2.Y2(MICIN2P) ; port MICIN2_P
PA4: U2.F5(PA4/UART0_TX/PA_EINT4) ; port PA4
PA17: U2.C14(PA17/SPDIF_OUT/PA_EINT17) ; port PA17
PE14: U2.C6(PE14) ; port PE14
PE15: U2.C5(PE15) ; port PE15
PF6: U2.G18(PF6) ; port PF6
PG11: U2.D2(PG11/PCM1_CLK/PG_EINT11) ; port PG11
PG12: U2.D1(PG12/PCM1_DOUTPG_EINT12) ; port PG12
PG13: U2.B1(PG13/PCM1_DIN/PG_EINT13) ; port PG13
PWR_OK: U2.V6(RESET) ; port AXP221S_POWEROK
SDC1_CLK: U2.J3(PG0/SDC1_CLK/PG_EINT0) ; port SDC1_CLK
SDC1_CMD: U2.L2(PG1/SDC1_CMD/PG_EINT1) ; port SDC1_CMD
SDC1_D0: U2.H4(PG2/SDC1_D0/PG_EINT2) ; port SDC1_D0
SDC1_D1: U2.F3(PG3/SDC1_D1/PG_EINT3) ; port SDC1_D1
SDC1_D2: U2.C2(PG4/SDC1_D2/PG_EINT4) ; port SDC1_D2
SDC1_D3: U2.C1(PG5/SDC1_D3/PG_EINT5) ; port SDC1_D3
SIM_DATA: U2.F13(PA8/SIM_DATA/PA_EINT8) ; port SIM_DATA
SIM_PWREN: U2.E14(PA6/SIM_PWREN/PWM1/PA_EINT6) ; port SIM_PWREN
SIM_RST: U2.D13(PA9/SIM_RST/PA_EINT9) ; port SIM_RST
SPI1_CLK: U2.G12(PA14/SPI1_CLK/UART3_RX/PA_EINT14) ; port SPI1_CLK
SPI1_CS: U2.E15(PA13/SPI1_CS/UART3_TX/PA_EINT13) ; port SPI1_CS
SPI1_MISO: U2.D15(PA16/SPI1_MISO/UART3_CTS/PA_EINT16) ; port SPI1_MISO
SPI1_MOSI: U2.F14(PA15/SPI1_MOSI/UART3_RTS/PA_EINT15) ; port SPI1_MOSI
TVOUT: U2.F10(TVOUT) ; port TVOUT
UART0_RX: U2.E21(PF4/SDC0_D3/UART0_RX) ; port UART0_RX
UART0_TX: U2.D20(PF2/SDC0_CLK/UART0_TX) ; port UART0_TX
UART1_RX: U2.D3(PG7/UART1_RX/PG_EINT7) ; port UART1_RX
UART1_TX: U2.G4(PG6/UART1_TX/PG_EINT6) ; port UART1_TX
UART2_RTS: U2.D6(PA2/UART2_RTS/JTAG_DO0/PA_EINT2) ; port UART2_RTS
UART2_RX: U2.D5(PA1/UART2_RX/JTAG_CK0/PA_EINT1) ; port UART2_RX
UART2_TX: U2.D11(PA0/UART2_TX/JTAG_MS0/PA_EINT0) ; port UART2_TX
UBOOT: U2.W6(UBOOT) ; port UBOOT
USB0_N: U2.B5(USB_DM0) ; port USB0_D_N
USB0_P: U2.A5(USB_DP0) ; port USB0_D_P
USB1_N: U2.B7(USB_DM1) ; port USB1_D_N
USB1_P: U2.B6(USB_DP1) ; port USB1_D_P
USB2_N: U2.A8(USB_DM2) ; port USB2_D_N
USB2_P: U2.A7(USB_DP2) ; port USB2_D_P
USB3_N: U2.B9(USB_DM3) ; port USB3_D_N
USB3_P: U2.B8(USB_DP3) ; port USB3_D_P
NetC53#1_2: C53#1.2 U2.H11(VDD_EFUSEBP)
NetC55_1: C55.1 U2.K1(X24MOUT) X1.2(OUT)
NetC56_1: C56.1 U2.K2(X24MIN) X1.1(IN)
NetC57_1: C57.1 U2.U4(X32KOUT) X2.2(OUT)
NetC58_1: C58.1 U2.V5(X32KIN) X2.1(IN)
NetC61#2_1: C61#2.1 C62#2.1 U2.V4(VRP)
NetC63_1: C63.1 U2.Y4(VRA1)
NetC64_1: C64.1 R17.1 U2.W5(VRA2)
NetR5_1: U2.M1(PL1/S_TWI_SDA/S_PL_EINT1) ; port AXP221S_I2C_SDA
NetR7_1: U2.N1(PL0/S_TWI_SCK/S_PL_EINT0) ; port AXP221S_I2C_SCL
NetR9_1: U2.P2(PL2/S_UART_TX/S_PL_EINT2) ; port AXP221S_IRQ
NetR15_1: R15.1 U2.AA6(NMI)
NetR16_1: R16.1 U2.AA5(KEYADC)
NetU1_28: U2.T10(VDD_CPUXFB) ; port CPUX-FB

Not connected (* = marked no-connect by the designer): U2 A1(JTAG_SEL0)* B2(JTAG_SEL)* C3(PG8/UART1_RTS/PG_EINT8)* D8(PA7/SIM_CLK/PA_EINT7)* E3(PG9/UART1_CTS/PG_EINT9)* E11(PA10/SIM_DET/PA_EINT10)* E13(PA3/UART2_CTS/JTAG_DI0/PA_EINT3)* H6(PA5/UART0_RX/PWM0/PA_EINT5)* K4(NC)* L5(PLLTEST)* M3(PG10/PCM1_SYNC/PG_EINT10)* N2(PL4/S_JTAG_MS/S_PL_EINT4)* P3(X32KFOUT)* R1(PL3/S_UART_RX/S_PL_EINT3)* R2(PL5/S_JTAG_CK/S_PL_EINT5)* T2(PL8/S_PL_EINT8)* T3(PL7/S_JTAG_SI/S_PL_EINT7)* T4(PL6/S_JTAG_DO/S_PL_EINT6)* T5(TEST)* W3(MBIAS)*; X2 3(G)*

### Notes on the sheet
- (in symbol H3_FBGA347, part C) GPIO G
- (in symbol H3_FBGA347, part D) GPIO A
- (in symbol H3_FBGA347, part E) CPUs
- (in symbol H3_FBGA347, part F) Audio Codec
- (in symbol H3_FBGA347, part G) USB
- (in symbol H3_FBGA347, part H) Power
- (in symbol H3_FBGA347, part I) GND
- (in symbol H3_FBGA347, part K) SYS
- (in symbol H3_FBGA347, part M) TV Out
- (in symbol H3_FBGA347, part O) GPIO F
- (in symbol H3_FBGA347, part P) GPIO E

### Library data of the parts
C53#1 C54#2 C64 = C_4.7UF
C53#2 C59 C61#1 C63 C69#1 = C_1UF
C54#1 C60#1 C60#2 C62#1 C62#2 C65 = C_0.1UF
C55 C56 = C_5PF
C57 C58 = C_15PF
C61#2 = C_10UF
R15 = R_47K
R16 = R_100K_P1
R17 = R_220K_P1
X1 = X_24MHZ
X2 = X_32768HZ

## Sheet 03_H3DRAM.SchDoc
size A2
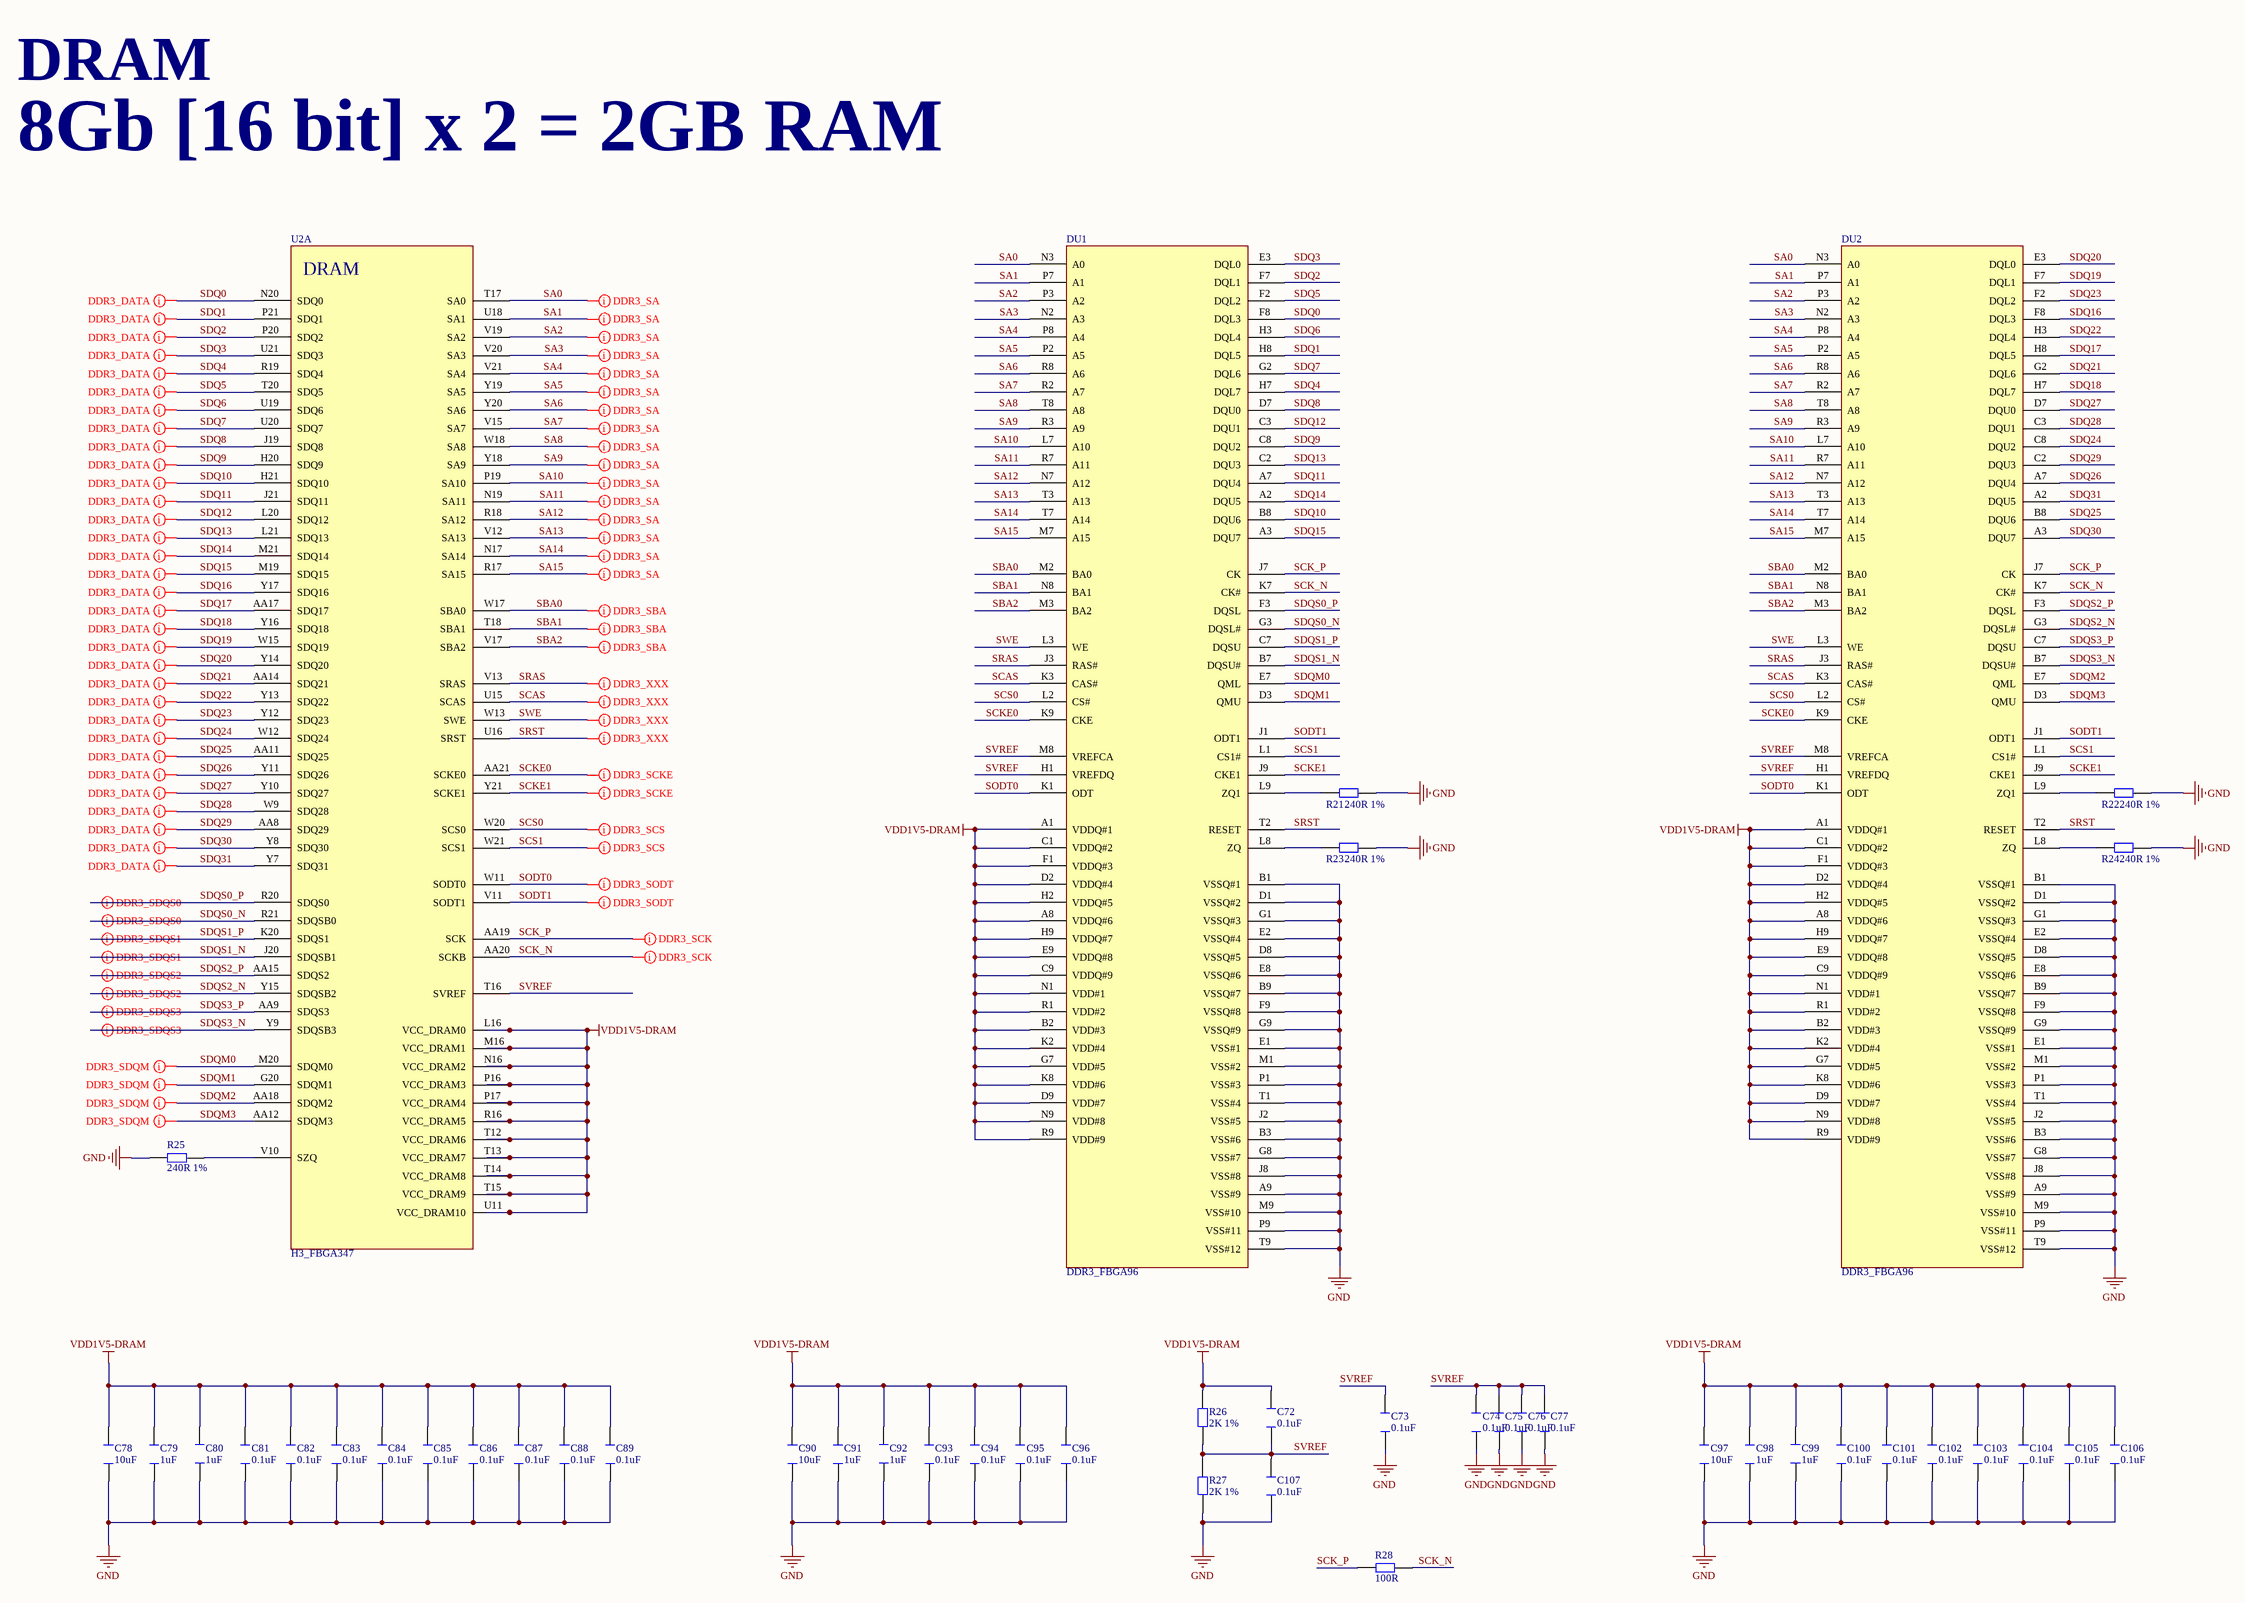
[diagram p8: 03_H3DRAM.SchDoc]

### Parts
(Parts that share a designator on the sheet are numbered #1, #2 ... from top to bottom, then left to right.)
C72#1  0.1uF  [C0402]
C73  0.1uF  [C0402]
C74  0.1uF  [C0402]
C75  0.1uF  [C0402]
C76  0.1uF  [C0402]
C77  0.1uF  [C0402]
C78#1  10uF  [C0402]
C79  1uF  [C0402]
C80  1uF  [C0402]
C81  0.1uF  [C0402]
C82  0.1uF  [C0402]
C83  0.1uF  [C0402]
C84  0.1uF  [C0402]
C85  0.1uF  [C0402]
C86  0.1uF  [C0402]
C87  0.1uF  [C0402]
C88  0.1uF  [C0402]
C89  0.1uF  [C0402]
C90  10uF  [C0402]
C91  1uF  [C0402]
C92  1uF  [C0402]
C93  0.1uF  [C0402]
C94  0.1uF  [C0402]
C95  0.1uF  [C0402]
C96  0.1uF  [C0402]
C97  10uF  [C0402]
C98  1uF  [C0402]
C99  1uF  [C0402]
C100  0.1uF  [C0402]
C101  0.1uF  [C0402]
C102  0.1uF  [C0402]
C103  0.1uF  [C0402]
C104  0.1uF  [C0402]
C105  0.1uF  [C0402]
C106  0.1uF  [C0402]
C107#1  0.1uF  [C0402]
DU1  DDR3_FBGA96  [DDR3_FBGA96]
DU2  DDR3_FBGA96  [DDR3_FBGA96]
R21#1  240R 1%  [R0402]
R22#1  240R 1%  [R0402]
R23  240R 1%  [R0402]
R24  240R 1%  [R0402]
R25  240R 1%  [R0402]
R26  2K 1%  [R0402]
R27  2K 1%  [R0402]
R28  100R  [R0402]
U2  H3_FBGA347  [H3_FBGA327]  (part A of 16)

### Nets
GND: C73.1 C74.1 C75.1 C76.1 C77.1 C78#1.1 C79.1 C80.2 C81.1 C82.1 C83.1 C84.1 C85.1 C86.1 C87.1 C88.1 C89.1 C90.1 C91.1 C92.2 C93.1 C94.1 C95.1 C96.1 C97.1 C98.1 C99.2 C100.1 C101.1 C102.1 C103.1 C104.1 C105.1 C106.1 C107#1.1 DU1.A9(VSS#9) DU1.B1(VSSQ#1) DU1.B3(VSS#6) DU1.B9(VSSQ#7) DU1.D1(VSSQ#2) DU1.D8(VSSQ#5) DU1.E1(VSS#1) DU1.E2(VSSQ#4) DU1.E8(VSSQ#6) DU1.F9(VSSQ#8) DU1.G1(VSSQ#3) DU1.G8(VSS#7) DU1.G9(VSSQ#9) DU1.J2(VSS#5) DU1.J8(VSS#8) DU1.M1(VSS#2) DU1.M9(VSS#10) DU1.P1(VSS#3) DU1.P9(VSS#11) DU1.T1(VSS#4) DU1.T9(VSS#12) DU2.A9(VSS#9) DU2.B1(VSSQ#1) DU2.B3(VSS#6) DU2.B9(VSSQ#7) DU2.D1(VSSQ#2) DU2.D8(VSSQ#5) DU2.E1(VSS#1) DU2.E2(VSSQ#4) DU2.E8(VSSQ#6) DU2.F9(VSSQ#8) DU2.G1(VSSQ#3) DU2.G8(VSS#7) DU2.G9(VSSQ#9) DU2.J2(VSS#5) DU2.J8(VSS#8) DU2.M1(VSS#2) DU2.M9(VSS#10) DU2.P1(VSS#3) DU2.P9(VSS#11) DU2.T1(VSS#4) DU2.T9(VSS#12) R21#1.1 R22#1.1 R23.1 R24.1 R25.1 R27.1
VDD1V5-DRAM: C72#1.2 C78#1.2 C79.2 C80.1 C81.2 C82.2 C83.2 C84.2 C85.2 C86.2 C87.2 C88.2 C89.2 C90.2 C91.2 C92.1 C93.2 C94.2 C95.2 C96.2 C97.2 C98.2 C99.1 C100.2 C101.2 C102.2 C103.2 C104.2 C105.2 C106.2 DU1.A1(VDDQ#1) DU1.A8(VDDQ#6) DU1.B2(VDD#3) DU1.C1(VDDQ#2) DU1.C9(VDDQ#9) DU1.D2(VDDQ#4) DU1.D9(VDD#7) DU1.E9(VDDQ#8) DU1.F1(VDDQ#3) DU1.G7(VDD#5) DU1.H2(VDDQ#5) DU1.H9(VDDQ#7) DU1.K2(VDD#4) DU1.K8(VDD#6) DU1.N1(VDD#1) DU1.N9(VDD#8) DU1.R1(VDD#2) DU1.R9(VDD#9) DU2.A1(VDDQ#1) DU2.A8(VDDQ#6) DU2.B2(VDD#3) DU2.C1(VDDQ#2) DU2.C9(VDDQ#9) DU2.D2(VDDQ#4) DU2.D9(VDD#7) DU2.E9(VDDQ#8) DU2.F1(VDDQ#3) DU2.G7(VDD#5) DU2.H2(VDDQ#5) DU2.H9(VDDQ#7) DU2.K2(VDD#4) DU2.K8(VDD#6) DU2.N1(VDD#1) DU2.N9(VDD#8) DU2.R1(VDD#2) DU2.R9(VDD#9) R26.2 U2.L16(VCC_DRAM0) U2.M16(VCC_DRAM1) U2.N16(VCC_DRAM2) U2.P16(VCC_DRAM3) U2.P17(VCC_DRAM4) U2.R16(VCC_DRAM5) U2.T12(VCC_DRAM6) U2.T13(VCC_DRAM7) U2.T14(VCC_DRAM8) U2.T15(VCC_DRAM9) U2.U11(VCC_DRAM10)  [project net VCC-1V5]
SA0: DU1.N3(A0) DU2.N3(A0) U2.T17(SA0)
SA1: DU1.P7(A1) DU2.P7(A1) U2.U18(SA1)
SA2: DU1.P3(A2) DU2.P3(A2) U2.V19(SA2)
SA3: DU1.N2(A3) DU2.N2(A3) U2.V20(SA3)
SA4: DU1.P8(A4) DU2.P8(A4) U2.V21(SA4)
SA5: DU1.P2(A5) DU2.P2(A5) U2.Y19(SA5)
SA6: DU1.R8(A6) DU2.R8(A6) U2.Y20(SA6)
SA7: DU1.R2(A7) DU2.R2(A7) U2.V15(SA7)
SA8: DU1.T8(A8) DU2.T8(A8) U2.W18(SA8)
SA9: DU1.R3(A9) DU2.R3(A9) U2.Y18(SA9)
SA10: DU1.L7(A10) DU2.L7(A10) U2.P19(SA10)
SA11: DU1.R7(A11) DU2.R7(A11) U2.N19(SA11)
SA12: DU1.N7(A12) DU2.N7(A12) U2.R18(SA12)
SA13: DU1.T3(A13) DU2.T3(A13) U2.V12(SA13)
SA14: DU1.T7(A14) DU2.T7(A14) U2.N17(SA14)
SA15: DU1.M7(A15) DU2.M7(A15) U2.R17(SA15)
SBA0: DU1.M2(BA0) DU2.M2(BA0) U2.W17(SBA0)
SBA1: DU1.N8(BA1) DU2.N8(BA1) U2.T18(SBA1)
SBA2: DU1.M3(BA2) DU2.M3(BA2) U2.V17(SBA2)
SCAS: DU1.K3(CAS#) DU2.K3(CAS#) U2.U15(SCAS)
SCK_N: DU1.K7(CK#) DU2.K7(CK#) R28.2 U2.AA20(SCKB)
SCK_P: DU1.J7(CK) DU2.J7(CK) R28.1 U2.AA19(SCK)
SCKE0: DU1.K9(CKE) DU2.K9(CKE) U2.AA21(SCKE0)
SCKE1: DU1.J9(CKE1) DU2.J9(CKE1) U2.Y21(SCKE1)
SCS0: DU1.L2(CS#) DU2.L2(CS#) U2.W20(SCS0)
SCS1: DU1.L1(CS1#) DU2.L1(CS1#) U2.W21(SCS1)
SDQ0: DU1.F8(DQL3) U2.N20(SDQ0)
SDQ1: DU1.H8(DQL5) U2.P21(SDQ1)
SDQ2: DU1.F7(DQL1) U2.P20(SDQ2)
SDQ3: DU1.E3(DQL0) U2.U21(SDQ3)
SDQ4: DU1.H7(DQL7) U2.R19(SDQ4)
SDQ5: DU1.F2(DQL2) U2.T20(SDQ5)
SDQ6: DU1.H3(DQL4) U2.U19(SDQ6)
SDQ7: DU1.G2(DQL6) U2.U20(SDQ7)
SDQ8: DU1.D7(DQU0) U2.J19(SDQ8)
SDQ9: DU1.C8(DQU2) U2.H20(SDQ9)
SDQ10: DU1.B8(DQU6) U2.H21(SDQ10)
SDQ11: DU1.A7(DQU4) U2.J21(SDQ11)
SDQ12: DU1.C3(DQU1) U2.L20(SDQ12)
SDQ13: DU1.C2(DQU3) U2.L21(SDQ13)
SDQ14: DU1.A2(DQU5) U2.M21(SDQ14)
SDQ15: DU1.A3(DQU7) U2.M19(SDQ15)
SDQ16: DU2.F8(DQL3) U2.Y17(SDQ16)
SDQ17: DU2.H8(DQL5) U2.AA17(SDQ17)
SDQ18: DU2.H7(DQL7) U2.Y16(SDQ18)
SDQ19: DU2.F7(DQL1) U2.W15(SDQ19)
SDQ20: DU2.E3(DQL0) U2.Y14(SDQ20)
SDQ21: DU2.G2(DQL6) U2.AA14(SDQ21)
SDQ22: DU2.H3(DQL4) U2.Y13(SDQ22)
SDQ23: DU2.F2(DQL2) U2.Y12(SDQ23)
SDQ24: DU2.C8(DQU2) U2.W12(SDQ24)
SDQ25: DU2.B8(DQU6) U2.AA11(SDQ25)
SDQ26: DU2.A7(DQU4) U2.Y11(SDQ26)
SDQ27: DU2.D7(DQU0) U2.Y10(SDQ27)
SDQ28: DU2.C3(DQU1) U2.W9(SDQ28)
SDQ29: DU2.C2(DQU3) U2.AA8(SDQ29)
SDQ30: DU2.A3(DQU7) U2.Y8(SDQ30)
SDQ31: DU2.A2(DQU5) U2.Y7(SDQ31)
SDQM0: DU1.E7(QML) U2.M20(SDQM0)
SDQM1: DU1.D3(QMU) U2.G20(SDQM1)
SDQM2: DU2.E7(QML) U2.AA18(SDQM2)
SDQM3: DU2.D3(QMU) U2.AA12(SDQM3)
SDQS0_N: DU1.G3(DQSL#) U2.R21(SDQSB0)
SDQS0_P: DU1.F3(DQSL) U2.R20(SDQS0)
SDQS1_N: DU1.B7(DQSU#) U2.J20(SDQSB1)
SDQS1_P: DU1.C7(DQSU) U2.K20(SDQS1)
SDQS2_N: DU2.G3(DQSL#) U2.Y15(SDQSB2)
SDQS2_P: DU2.F3(DQSL) U2.AA15(SDQS2)
SDQS3_N: DU2.B7(DQSU#) U2.Y9(SDQSB3)
SDQS3_P: DU2.C7(DQSU) U2.AA9(SDQS3)
SODT0: DU1.K1(ODT) DU2.K1(ODT) U2.W11(SODT0)
SODT1: DU1.J1(ODT1) DU2.J1(ODT1) U2.V11(SODT1)
SRAS: DU1.J3(RAS#) DU2.J3(RAS#) U2.V13(SRAS)
SRST: DU1.T2(RESET) DU2.T2(RESET) U2.U16(SRST)
SVREF: C72#1.1 C73.2 C74.2 C75.2 C76.2 C77.2 C107#1.2 DU1.H1(VREFDQ) DU1.M8(VREFCA) DU2.H1(VREFDQ) DU2.M8(VREFCA) R26.1 R27.2 U2.T16(SVREF)
SWE: DU1.L3(WE) DU2.L3(WE) U2.W13(SWE)
NetDU1_L8: DU1.L8(ZQ) R23.2
NetDU1_L9: DU1.L9(ZQ1) R21#1.2
NetDU2_L8: DU2.L8(ZQ) R24.2
NetDU2_L9: DU2.L9(ZQ1) R22#1.2
NetR25_2: R25.2 U2.V10(SZQ)

### Layout directives
net class DDR3_ADDR; rule Width Constraint [Pref Width = 0.127mm    Min Width = 0.127mm    Max Width = 0.127mm]; net class DDR3: SA0, SA1, SA2, SA3, SA4, SA5, SA6, SA7, SA8, SA9, SA10, SA11, SA12, SA13, SA14, SA15
net class DDR3_DATA; rule Width Constraint [Pref Width = 0.127mm    Min Width = 0.127mm    Max Width = 0.127mm]; net class DDR3_DQS1; net class DDR3: SDQ8, SDQ9, SDQ10, SDQ11, SDQ12, SDQ13, SDQ14, SDQ15
net class DDR3_DATA; rule Width Constraint [Pref Width = 0.127mm    Min Width = 0.127mm    Max Width = 0.127mm]; net class DDR3_DQS0; net class DDR3: SDQ0, SDQ1, SDQ2, SDQ3, SDQ4, SDQ5, SDQ6, SDQ7
net class DDR3_DATA; rule Width Constraint [Pref Width = 0.127mm    Min Width = 0.127mm    Max Width = 0.127mm]; net class DDR3_DQS3; net class DDR3: SDQ24, SDQ25, SDQ26, SDQ27, SDQ28, SDQ29, SDQ30, SDQ31
net class DDR3_DATA; rule Width Constraint [Pref Width = 0.127mm    Min Width = 0.127mm    Max Width = 0.127mm]; net class DDR3_DQS2; net class DDR3: SDQ16, SDQ17, SDQ18, SDQ19, SDQ20, SDQ21, SDQ22, SDQ23
differential pair; differential pair class DDR3_DIFF_DQS0; rule Differential Pairs Routing [Pref Gap = 6mil    Min Gap  = 6mil    Max Gap  = 6milPref Width = 4.29mil    Min Width  = 4.29mil    Max Width  = 4.29mil]; net class DDR3_DIFF_DQS0; net class DDR3_DQS0; net class DDR3: SDQS0_N, SDQS0_P
differential pair; differential pair class DDR3_DIFF_DQS1; rule Differential Pairs Routing [Pref Gap = 6mil    Min Gap  = 6mil    Max Gap  = 6milPref Width = 4.29mil    Min Width  = 4.29mil    Max Width  = 4.29mil]; net class DDR3_DIFF_DQS1; net class DDR3_DQS1; net class DDR3: SDQS1_N, SDQS1_P
differential pair; differential pair class DDR3_DIFF_DQS2; rule Differential Pairs Routing [Pref Gap = 6mil    Min Gap  = 6mil    Max Gap  = 6milPref Width = 4.29mil    Min Width  = 4.29mil    Max Width  = 4.29mil]; net class DDR3_DIFF_DQS2; net class DDR3_DQS2; net class DDR3: SDQS2_N, SDQS2_P
differential pair; differential pair class DDR3_DIFF_DQS3; rule Differential Pairs Routing [Pref Gap = 6mil    Min Gap  = 6mil    Max Gap  = 6milPref Width = 4.29mil    Min Width  = 4.29mil    Max Width  = 4.29mil]; net class DDR3_DIFF_DQS3; net class DDR3_DQS3; net class DDR3: SDQS3_N, SDQS3_P
net class DDR3_DQM; rule Width Constraint [Pref Width = 0.127mm    Min Width = 0.127mm    Max Width = 0.127mm]; net class DDR3; net class DDR3_DQS3: SDQM3
net class DDR3_DQM; rule Width Constraint [Pref Width = 0.127mm    Min Width = 0.127mm    Max Width = 0.127mm]; net class DDR3; net class DDR3_DQS2: SDQM2
net class DDR3_DQM; rule Width Constraint [Pref Width = 0.127mm    Min Width = 0.127mm    Max Width = 0.127mm]; net class DDR3; net class DDR3_DQS1: SDQM1
net class DDR3_DQM; rule Width Constraint [Pref Width = 0.127mm    Min Width = 0.127mm    Max Width = 0.127mm]; net class DDR3; net class DDR3_DQS0: SDQM0
net class DDR3_BA; rule Width Constraint [Pref Width = 0.127mm    Min Width = 0.127mm    Max Width = 0.127mm]; net class DDR3: SBA0, SBA1, SBA2
net class DDR3_ODT; rule Width Constraint [Pref Width = 0.127mm    Min Width = 0.127mm    Max Width = 0.127mm]; net class DDR3: SODT0, SODT1
net class DDR3_CS; rule Width Constraint [Pref Width = 0.127mm    Min Width = 0.127mm    Max Width = 0.127mm]; net class DDR3: SCS0, SCS1
net class DDR3_CKE; rule Width Constraint [Pref Width = 0.127mm    Min Width = 0.127mm    Max Width = 0.127mm]; net class DDR3: SCKE0, SCKE1
net class DDR3_XXX; rule Width Constraint [Pref Width = 0.127mm    Min Width = 0.127mm    Max Width = 0.127mm]; net class DDR3: SCAS, SRAS, SRST, SWE
differential pair; differential pair class DDR3_CK; rule Differential Pairs Routing [Pref Gap = 6mil    Min Gap  = 6mil    Max Gap  = 6milPref Width = 4.29mil    Min Width  = 4.29mil    Max Width  = 4.29mil]; net class DDR3_DIFF_CK; net class DDR3: SCK_N, SCK_P

### Notes on the sheet
- DRAM
- 8Gb [16 bit] x 2 = 2GB RAM
- (in symbol H3_FBGA347, part A) DRAM

### Library data of the parts
C72#1 C73-C77 C81-C89 C93-C96 C100-C106 C107#1 = C_0.1UF
C78#1 C90 C97 = C_10UF
C79 C80 C91 C92 C98 C99 = C_1UF
R21#1 R22#1 R23-R25 = R_240R_P1
R26 R27 = R_2K_P1
R28 = R_100R

## Sheet 04_H3STORAGE.SchDoc
size A2
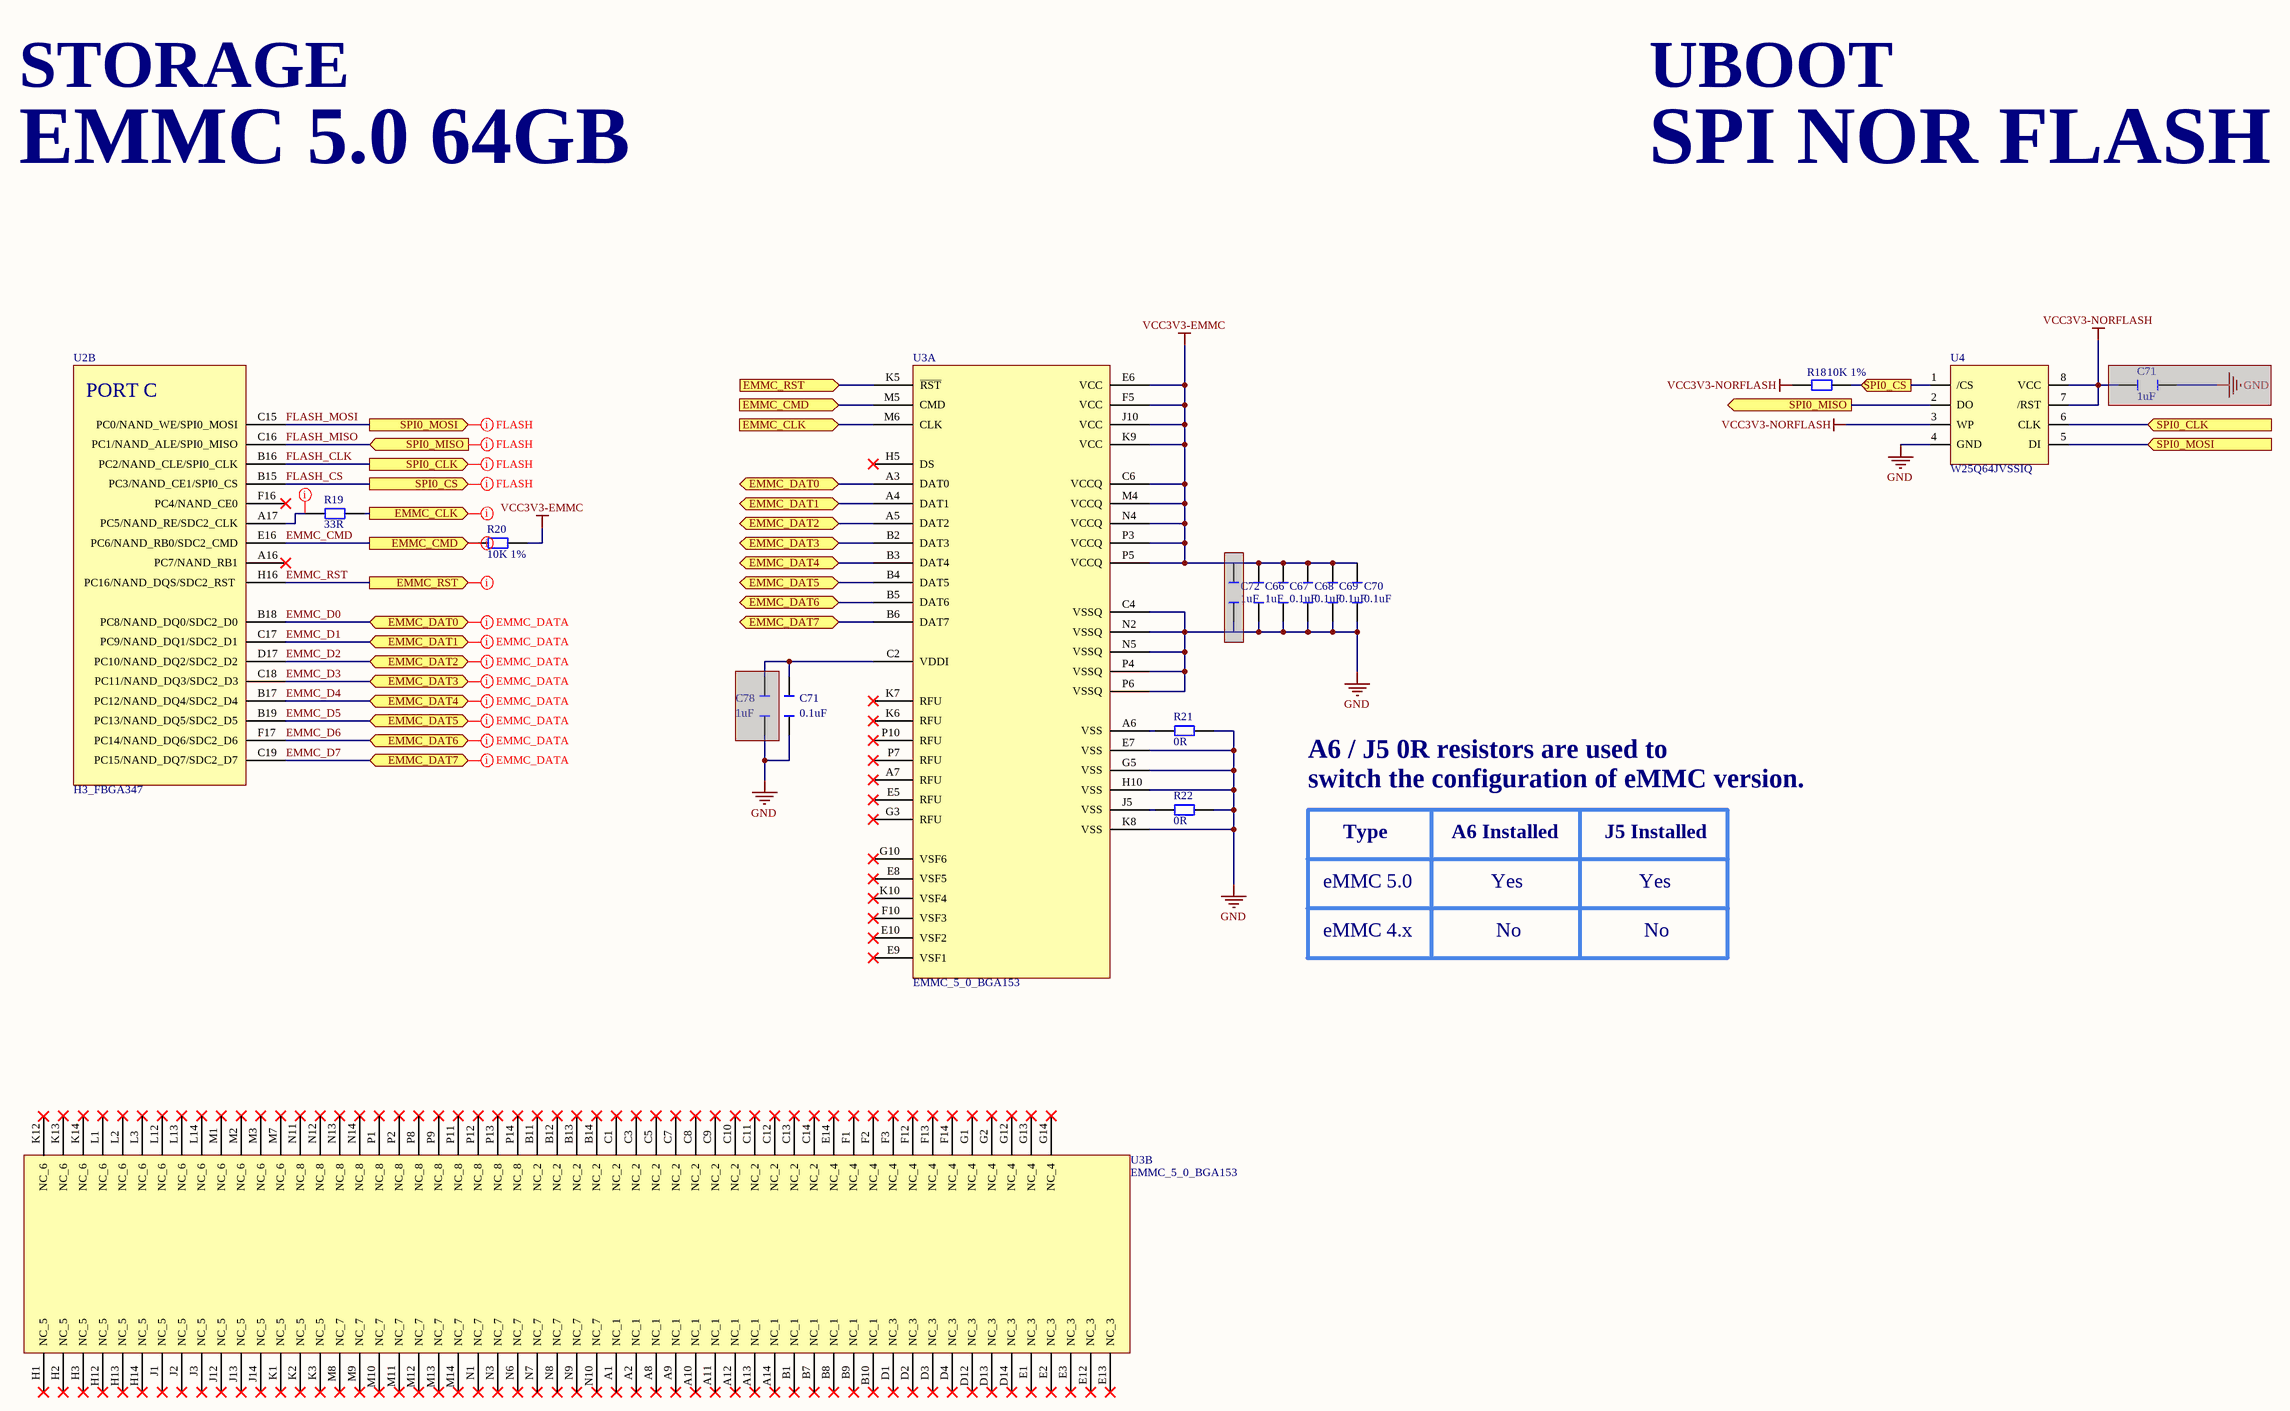
[diagram p9: 04_H3STORAGE.SchDoc]

### Parts
(Parts that share a designator on the sheet are numbered #1, #2 ... from top to bottom, then left to right.)
C66  1uF  [C0402]
C67  0.1uF  [C0402]
C68  0.1uF  [C0402]
C69#2  0.1uF  [C0402]
C70  0.1uF  [C0402]
C71#1  1uF  [C0402]  (masked out: inside a compile mask, not in the netlist)
C71#2  0.1uF  [C0603]
C72#2  1uF  [C0402]  (masked out: inside a compile mask, not in the netlist)
C78#2  1uF  [C0402]  (masked out: inside a compile mask, not in the netlist)
R18  10K 1%  [R0402]
R19  33R  [R0402]
R20  10K 1%  [R0402]
R21#2  0R  [R0402]
R22#2  0R  [R0402]
U2  H3_FBGA347  [H3_FBGA327]  (part B of 16)
U3  EMMC_5_0_BGA153  [EMMC_BGA153]  (parts A,B of 2)
U4  W25Q64JVSSIQ  [W25Q64JVSSIQ]

### Ports
EMMC_CLK (in), EMMC_CLK (out), EMMC_CMD (in), EMMC_CMD (out), EMMC_DAT0 (bidir), EMMC_DAT1 (bidir), EMMC_DAT2 (bidir), EMMC_DAT3 (bidir), EMMC_DAT4 (bidir), EMMC_DAT5 (bidir), EMMC_DAT6 (bidir), EMMC_DAT7 (bidir), EMMC_RST (in), EMMC_RST (out), SPI0_CLK (in), SPI0_CLK (out), SPI0_CS (in), SPI0_CS (out), SPI0_MISO (in), SPI0_MISO (out), SPI0_MOSI (in), SPI0_MOSI (out)

### Nets
GND: C66.1 C67.1 C68.1 C69#2.1 C70.1 C71#2.1 R21#2.2 R22#2.2 U3.C4(VSSQ) U3.E7(VSS) U3.G5(VSS) U3.H10(VSS) U3.K8(VSS) U3.N2(VSSQ) U3.N5(VSSQ) U3.P4(VSSQ) U3.P6(VSSQ) U4.4(GND)
VCC3V3-EMMC: C66.2 C67.2 C68.2 C69#2.2 C70.2 R18.1 R20.2 U3.C6(VCCQ) U3.E6(VCC) U3.F5(VCC) U3.J10(VCC) U3.K9(VCC) U3.M4(VCCQ) U3.N4(VCCQ) U3.P3(VCCQ) U3.P5(VCCQ) U4.3(WP) U4.7(/RST) U4.8(VCC)  [also labelled VCC3V3-NORFLASH]  [project net VCC-3V3]
EMMC_CMD: R20.1 U2.E16(PC6/NAND_RB0/SDC2_CMD) U3.M5(CMD) ; port EMMC_CMD
EMMC_D0: U2.B18(PC8/NAND_DQ0/SDC2_D0) U3.A3(DAT0) ; port EMMC_DAT0
EMMC_D1: U2.C17(PC9/NAND_DQ1/SDC2_D1) U3.A4(DAT1) ; port EMMC_DAT1
EMMC_D2: U2.D17(PC10/NAND_DQ2/SDC2_D2) U3.A5(DAT2) ; port EMMC_DAT2
EMMC_D3: U2.C18(PC11/NAND_DQ3/SDC2_D3) U3.B2(DAT3) ; port EMMC_DAT3
EMMC_D4: U2.B17(PC12/NAND_DQ4/SDC2_D4) U3.B3(DAT4) ; port EMMC_DAT4
EMMC_D5: U2.B19(PC13/NAND_DQ5/SDC2_D5) U3.B4(DAT5) ; port EMMC_DAT5
EMMC_D6: U2.F17(PC14/NAND_DQ6/SDC2_D6) U3.B5(DAT6) ; port EMMC_DAT6
EMMC_D7: U2.C19(PC15/NAND_DQ7/SDC2_D7) U3.B6(DAT7) ; port EMMC_DAT7
EMMC_RST: U2.H16(PC16/NAND_DQS/SDC2_RST) U3.K5(~{RST}) ; port EMMC_RST
FLASH_CLK: U2.B16(PC2/NAND_CLE/SPI0_CLK) U4.6(CLK) ; port SPI0_CLK
FLASH_CS: R18.2 U2.B15(PC3/NAND_CE1/SPI0_CS) U4.1(/CS) ; port SPI0_CS
FLASH_MISO: U2.C16(PC1/NAND_ALE/SPI0_MISO) U4.2(DO) ; port SPI0_MISO
FLASH_MOSI: U2.C15(PC0/NAND_WE/SPI0_MOSI) U4.5(DI) ; port SPI0_MOSI
NetC71#2_2: C71#2.2 U3.C2(VDDI)
NetR19_1: R19.1 U2.A17(PC5/NAND_RE/SDC2_CLK)
NetR19_2: R19.2 U3.M6(CLK) ; port EMMC_CLK
NetR21#2_1: R21#2.1 U3.A6(VSS)
NetR22#2_1: R22#2.1 U3.J5(VSS)

Not connected (* = marked no-connect by the designer): U2 A16(PC7/NAND_RB1)* F16(PC4/NAND_CE0)*; U3 A1(NC_1)* A2(NC_1)* A7(RFU)* A8(NC_1)* A9(NC_1)* A10(NC_1)* A11(NC_1)* A12(NC_1)* A13(NC_1)* A14(NC_1)* B1(NC_1)* B7(NC_1)* B8(NC_1)* B9(NC_1)* B10(NC_1)* B11(NC_2)* B12(NC_2)* B13(NC_2)* B14(NC_2)* C1(NC_2)* C3(NC_2)* C5(NC_2)* C7(NC_2)* C8(NC_2)* C9(NC_2)* C10(NC_2)* C11(NC_2)* C12(NC_2)* C13(NC_2)* C14(NC_2)* D1(NC_3)* D2(NC_3)* D3(NC_3)* D4(NC_3)* D12(NC_3)* D13(NC_3)* D14(NC_3)* E1(NC_3)* E2(NC_3)* E3(NC_3)* E5(RFU)* E8(VSF5)* E9(VSF1)* E10(VSF2)* E12(NC_3)* E13(NC_3)* E14(NC_4)* F1(NC_4)* F2(NC_4)* F3(NC_4)* F10(VSF3)* F12(NC_4)* F13(NC_4)* F14(NC_4)* G1(NC_4)* G2(NC_4)* G3(RFU)* G10(VSF6)* G12(NC_4)* G13(NC_4)* G14(NC_4)* H1(NC_5)* H2(NC_5)* H3(NC_5)* H5(DS)* H12(NC_5)* H13(NC_5)* H14(NC_5)* J1(NC_5)* J2(NC_5)* J3(NC_5)* J12(NC_5)* J13(NC_5)* J14(NC_5)* K1(NC_5)* K2(NC_5)* K3(NC_5)* K6(RFU)* K7(RFU)* K10(VSF4)* K12(NC_6)* K13(NC_6)* K14(NC_6)* L1(NC_6)* L2(NC_6)* L3(NC_6)* L12(NC_6)* L13(NC_6)* L14(NC_6)* M1(NC_6)* M2(NC_6)* M3(NC_6)* M7(NC_6)* M8(NC_7)* M9(NC_7)* M10(NC_7)* M11(NC_7)* M12(NC_7)* M13(NC_7)* M14(NC_7)* N1(NC_7)* N3(NC_7)* N6(NC_7)* N7(NC_7)* N8(NC_7)* N9(NC_7)* N10(NC_7)* N11(NC_8)* N12(NC_8)* N13(NC_8)* N14(NC_8)* P1(NC_8)* P2(NC_8)* P7(RFU)* P8(NC_8)* P9(NC_8)* P10(RFU)* P11(NC_8)* P12(NC_8)* P13(NC_8)* P14(NC_8)*

### Layout directives
net class EMMC_DATA; rule Width Constraint [Pref Width = 0.127mm    Min Width = 0.127mm    Max Width = 0.127mm]: EMMC_D0, EMMC_D1, EMMC_D2, EMMC_D3, EMMC_D4, EMMC_D5, EMMC_D6, EMMC_D7
net class FLASH; rule Width Constraint [Pref Width = 0.127mm    Min Width = 0.127mm    Max Width = 0.127mm]: FLASH_CLK, FLASH_CS, FLASH_MISO, FLASH_MOSI
net class EMMC_CTL; rule Width Constraint [Pref Width = 0.127mm    Min Width = 0.127mm    Max Width = 0.127mm]: EMMC_CMD, EMMC_RST, NetR19_1, NetR19_2

### Notes on the sheet
- STORAGE
- UBOOT
- EMMC 5.0 64GB
- SPI NOR FLASH
- A6 / J5 0R resistors are used to
- switch the configuration of eMMC version.
- Type
- A6 Installed
- J5 Installed
- eMMC 5.0
- Yes
- eMMC 4.x
- No
- (in symbol H3_FBGA347, part B) PORT C

### Library data of the parts
C66 C71#1 C72#2 C78#2 = C_1UF
C67 C68 C69#2 C70 C71#2 = C_0.1UF
R18 R20 = R_10K_P1
R19 = R_33R
R21#2 R22#2 = R_0R

## Sheet 06_H3ETHERNET.SchDoc
size A3
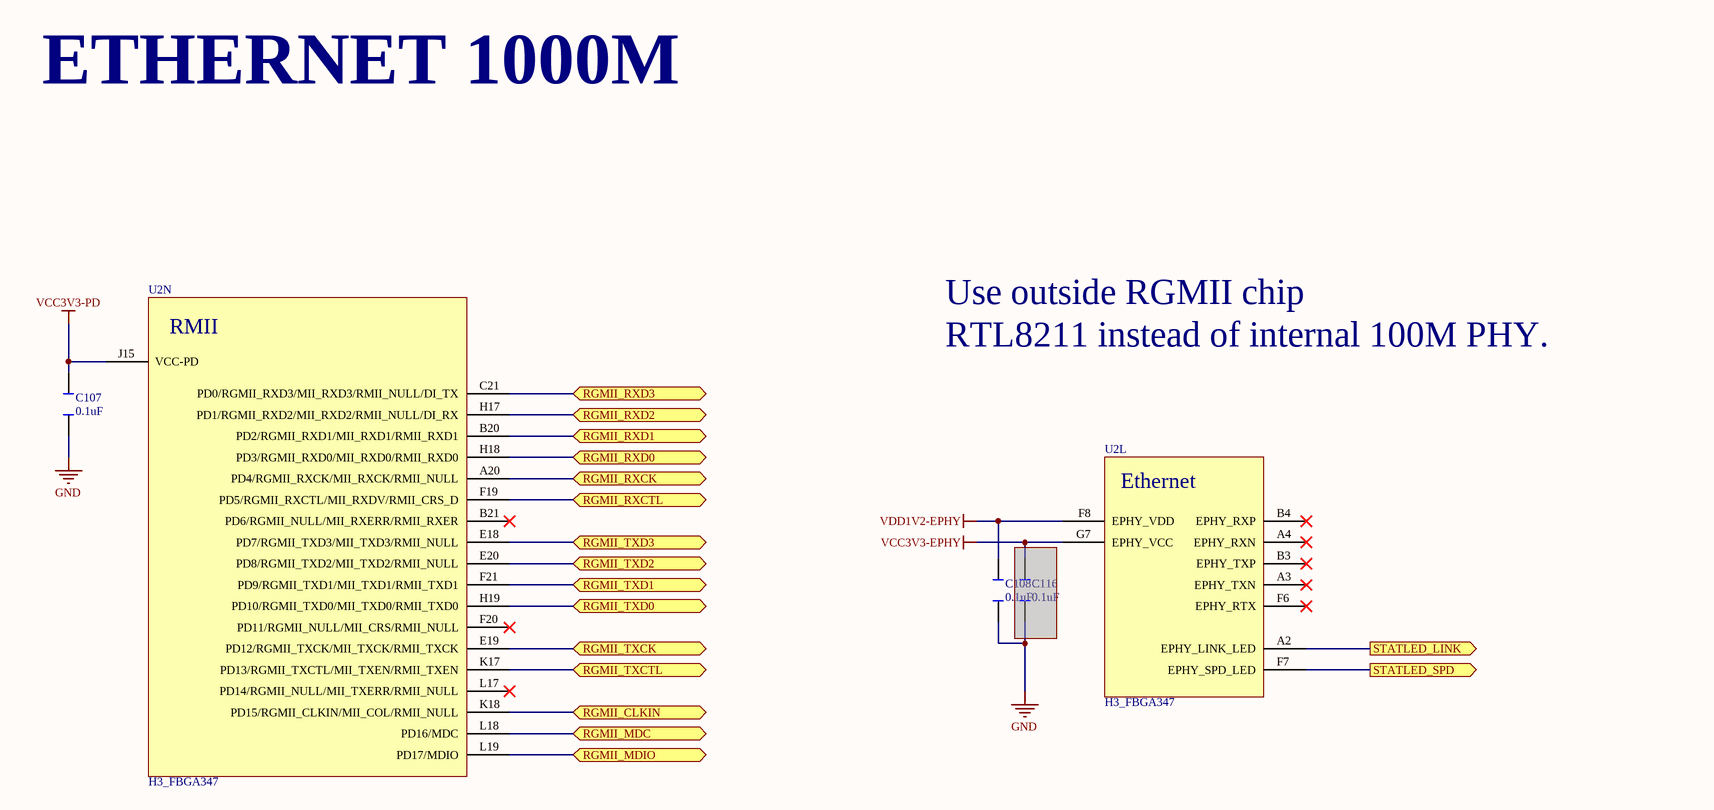
[diagram p10: 06_H3ETHERNET.SchDoc]

### Parts
(Parts that share a designator on the sheet are numbered #1, #2 ... from top to bottom, then left to right.)
C107#2  0.1uF  [C0402]
C108  0.1uF  [C0402]
C116  0.1uF  [C0402]  (masked out: inside a compile mask, not in the netlist)
U2  H3_FBGA347  [H3_FBGA327]  (parts L,N of 16)

### Ports
RGMII_CLKIN (bidir), RGMII_MDC (bidir), RGMII_MDIO (bidir), RGMII_RXCK (bidir), RGMII_RXCTL (bidir), RGMII_RXD0 (bidir), RGMII_RXD1 (bidir), RGMII_RXD2 (bidir), RGMII_RXD3 (bidir), RGMII_TXCK (bidir), RGMII_TXCTL (bidir), RGMII_TXD0 (bidir), RGMII_TXD1 (bidir), RGMII_TXD2 (bidir), RGMII_TXD3 (bidir), STATLED_LINK (out), STATLED_SPD (out)

### Nets
GND: C107#2.1 C108.1
VCC3V3-EPHY: C107#2.2 U2.G7(EPHY_VCC) U2.J15(VCC-PD)  [also labelled VCC3V3-PD]  [project net VCC-3V3]
VDD1V2-EPHY: C108.2 U2.F8(EPHY_VDD)
LED_LINK: U2.A2(EPHY_LINK_LED) ; port STATLED_LINK
LED_SPD: U2.F7(EPHY_SPD_LED) ; port STATLED_SPD
RGMII_CLKIN: U2.K18(PD15/RGMII_CLKIN/MII_COL/RMII_NULL) ; port RGMII_CLKIN
RGMII_MDC: U2.L18(PD16/MDC) ; port RGMII_MDC
RGMII_MDIO: U2.L19(PD17/MDIO) ; port RGMII_MDIO
RGMII_RX0: U2.H18(PD3/RGMII_RXD0/MII_RXD0/RMII_RXD0) ; port RGMII_RXD0
RGMII_RX1: U2.B20(PD2/RGMII_RXD1/MII_RXD1/RMII_RXD1) ; port RGMII_RXD1
RGMII_RX2: U2.H17(PD1/RGMII_RXD2/MII_RXD2/RMII_NULL/DI_RX) ; port RGMII_RXD2
RGMII_RX3: U2.C21(PD0/RGMII_RXD3/MII_RXD3/RMII_NULL/DI_TX) ; port RGMII_RXD3
RGMII_RXCK: U2.A20(PD4/RGMII_RXCK/MII_RXCK/RMII_NULL) ; port RGMII_RXCK
RGMII_RXCTL: U2.F19(PD5/RGMII_RXCTL/MII_RXDV/RMII_CRS_D) ; port RGMII_RXCTL
RGMII_TXCK: U2.E19(PD12/RGMII_TXCK/MII_TXCK/RMII_TXCK) ; port RGMII_TXCK
RGMII_TXCTL: U2.K17(PD13/RGMII_TXCTL/MII_TXEN/RMII_TXEN) ; port RGMII_TXCTL
RGMII_TXD0: U2.H19(PD10/RGMII_TXD0/MII_TXD0/RMII_TXD0) ; port RGMII_TXD0
RGMII_TXD1: U2.F21(PD9/RGMII_TXD1/MII_TXD1/RMII_TXD1) ; port RGMII_TXD1
RGMII_TXD2: U2.E20(PD8/RGMII_TXD2/MII_TXD2/RMII_NULL) ; port RGMII_TXD2
RGMII_TXD3: U2.E18(PD7/RGMII_TXD3/MII_TXD3/RMII_NULL) ; port RGMII_TXD3

Not connected (* = marked no-connect by the designer): U2 A3(EPHY_TXN)* A4(EPHY_RXN)* B3(EPHY_TXP)* B4(EPHY_RXP)* B21(PD6/RGMII_NULL/MII_RXERR/RMII_RXER)* F6(EPHY_RTX)* F20(PD11/RGMII_NULL/MII_CRS/RMII_NULL)* L17(PD14/RGMII_NULL/MII_TXERR/RMII_NULL)*

### Notes on the sheet
- ETHERNET 1000M
- Use outside RGMII chip
- RTL8211 instead of internal 100M PHY.
- (in symbol H3_FBGA347, part L) Ethernet
- (in symbol H3_FBGA347, part N) RMII

### Library data of the parts
C107#2 C108 C116 = C_0.1UF

## Sheet 07_H3HDMI.SchDoc
size A3
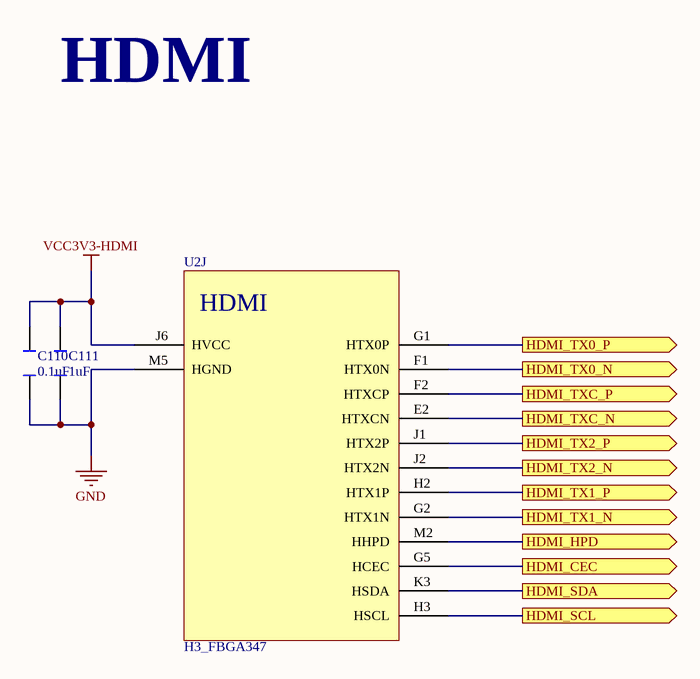
[diagram p11: 07_H3HDMI.SchDoc]

### Parts
C110  0.1uF  [C0402]
C111  1uF  [C0402]
U2  H3_FBGA347  [H3_FBGA327]  (part J of 16)

### Ports
HDMI_CEC (out), HDMI_HPD (out), HDMI_SCL (out), HDMI_SDA (out), HDMI_TX0_N (out), HDMI_TX0_P (out), HDMI_TX1_N (out), HDMI_TX1_P (out), HDMI_TX2_N (out), HDMI_TX2_P (out), HDMI_TXC_N (out), HDMI_TXC_P (out)

### Nets
GND: C110.1 C111.1 U2.M5(HGND)
VCC3V3-HDMI: C110.2 C111.2 U2.J6(HVCC)  [project net VCC-3V3]
HDMI_CEC: U2.G5(HCEC) ; port HDMI_CEC
HDMI_HPD: U2.M2(HHPD) ; port HDMI_HPD
HDMI_SCL: U2.H3(HSCL) ; port HDMI_SCL
HDMI_SDA: U2.K3(HSDA) ; port HDMI_SDA
HDMI_TX0_N: U2.F1(HTX0N) ; port HDMI_TX0_N
HDMI_TX0_P: U2.G1(HTX0P) ; port HDMI_TX0_P
HDMI_TX1_N: U2.G2(HTX1N) ; port HDMI_TX1_N
HDMI_TX1_P: U2.H2(HTX1P) ; port HDMI_TX1_P
HDMI_TX2_N: U2.J2(HTX2N) ; port HDMI_TX2_N
HDMI_TX2_P: U2.J1(HTX2P) ; port HDMI_TX2_P
HDMI_TXC_N: U2.E2(HTXCN) ; port HDMI_TXC_N
HDMI_TXC_P: U2.F2(HTXCP) ; port HDMI_TXC_P

### Notes on the sheet
- HDMI
- (in symbol H3_FBGA347, part J) HDMI

### Library data of the parts
C110 = C_0.1UF
C111 = C_1UF